# EasyEDA Pro project group_project chess_2025-11-06.epro

# Schematic Schematic1
Board Name: Board1; Create Date: 2025-10-16; Page Name: P1; Project Name: group_project chess; Schematic Name: Schematic1; Update Date: 2025-10-27; Company: EasyEDA.com; Page Size: A4; Version: V1.0
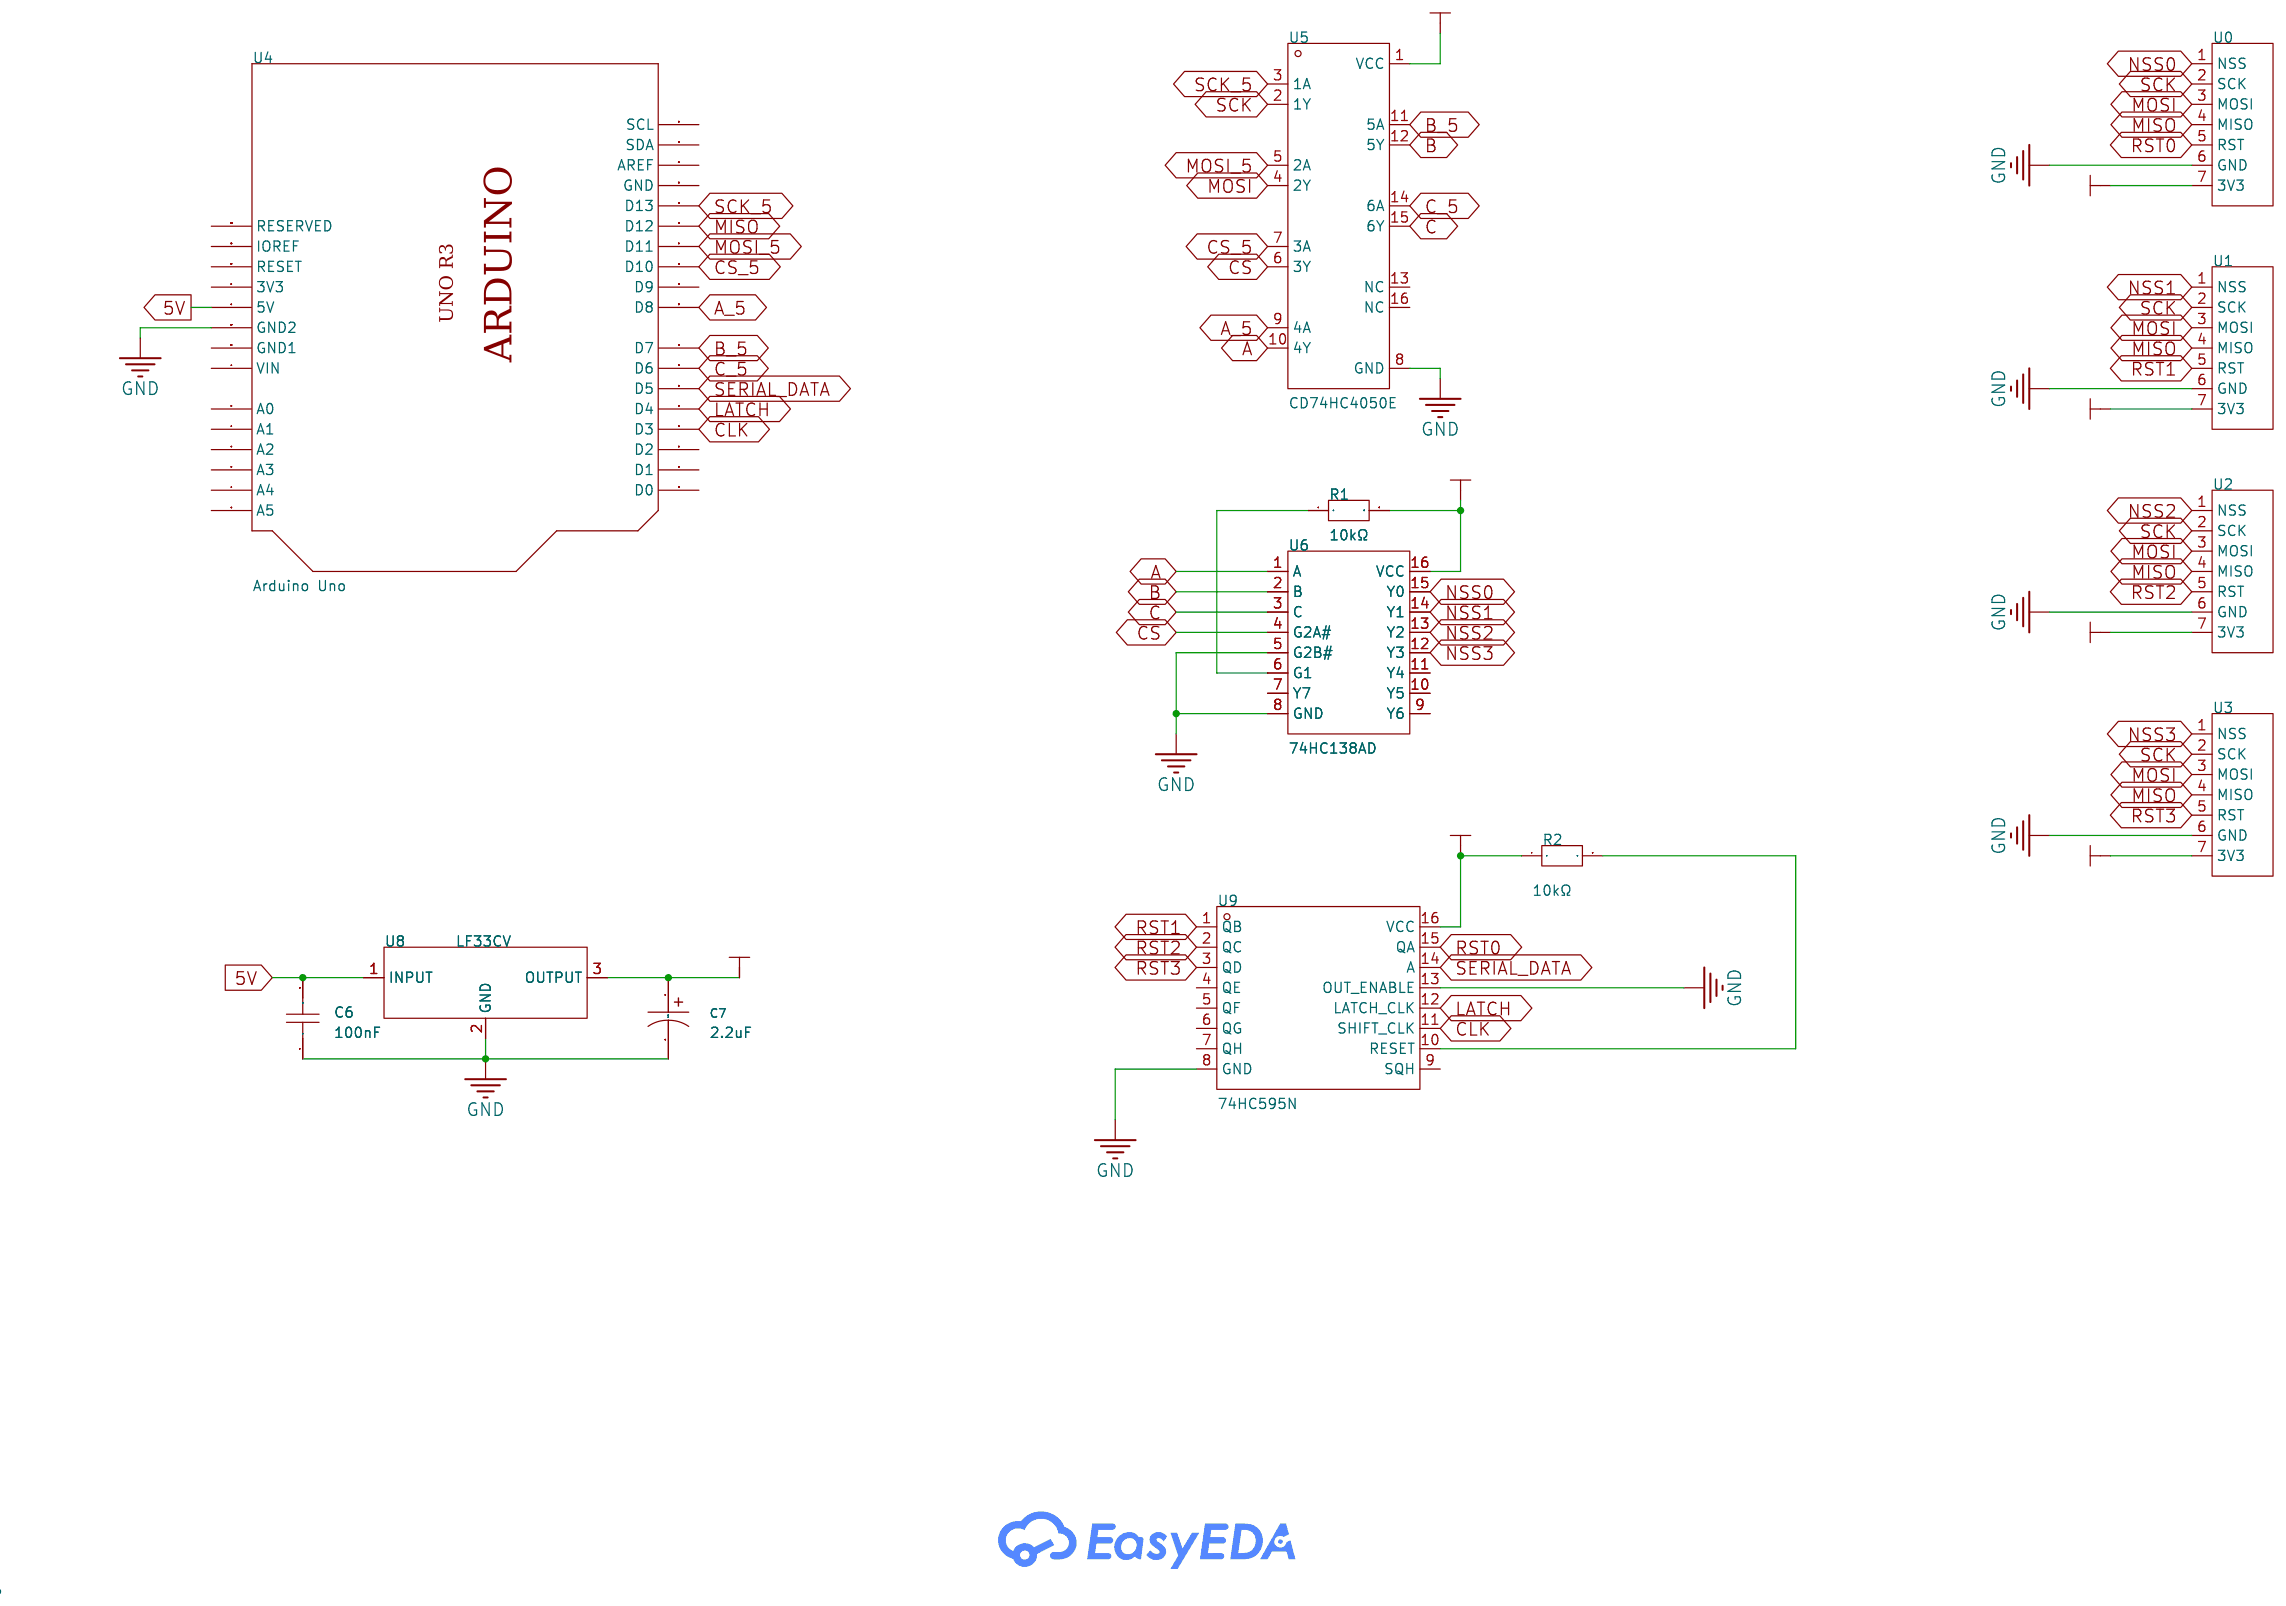
[diagram p0: schematic sheet]

## Parts
C6  100nF  [CAP-TH_L7.2-W2.5-P5.00-D0.5]
C7  2.2uF  [CAP-TH_BD6.3-P2.50-D1.0-FD]
R1  10kΩ  [RES-TH_BD2.7-L6.2-P10.20-D0.4]
R2  10kΩ  [RES-TH_BD2.7-L6.2-P10.20-D0.4]
U0  HB-PH3-25417PB2GOP  [HDR-TH_7P-P2.54-V-M]
U1  HB-PH3-25417PB2GOP  [HDR-TH_7P-P2.54-V-M]
U2  HB-PH3-25417PB2GOP  [HDR-TH_7P-P2.54-V-M]
U3  HB-PH3-25417PB2GOP  [HDR-TH_7P-P2.54-V-M]
U4  Arduino Uno  [ARDUINO-R3]
U5  CD74HC4050E  [PDIP-16_L19.3-W6.4-P2.54-LS7.94-BL]
U6  74HC138AD  [PDIP-16_L19.7-W6.6-P2.54-LS7.6-BL]
U8  LF33CV  [TO-220-3_L10.2-W4.5-P2.54-L]
U9  74HC595N  [DIP-16_L19.8-W6.5-P2.54-LS7.6-BL]

## Library data of the parts
C6 = 224CL0017: Capacitance:100nF Tolerance:±5% Tolerance:±5% Voltage Rating:63V Dielectric Material:Metallized Polyester Operating Temperature:-55℃~+105℃ Operating Temperature:-55℃~+105℃; LCSC Part Name: 100nF ±5% 63V; Supplier Part: C47917080; Manufacturer: KNSCHA(科尼盛); Supplier Footprint: 插件,P=5mm; JLCPCB Part Class: Extended Part; Datasheet: https://item.szlcsc.com/datasheet/224CL0017/50153037.html; Supplier: LCSC; Tolerance: ±5%; Voltage Rating: 63V; Dielectric Material: Metallized Polyester; Operating Temperature: -55℃~+105℃
C7 = ECG2GM2R2E09OTBO: Capacitance:2.2uF Tolerance:±20% Tolerance:±20% Voltage Rating:400V Ripple Current:70mA@100kHz Equivalent Series Resistance(ESR):- Pin Spacing:2.5mm Diameter:6.3mm Height - Seated (Max):9mm Lifetime:8000hrs@105℃; LCSC Part Name: 2.2uF ±20% 400V; Supplier Part: C525475; Manufacturer: Yunxing(云星); Supplier Footprint: 插件,D6.3xL9mm; JLCPCB Part Class: Extended Part; Datasheet: https://item.szlcsc.com/datasheet/ECG2GM2R2E09OTBO/543602.html; Supplier: LCSC; Tolerance: ±20%; Voltage Rating: 400V; Ripple Current: 70mA@100kHz; Pin Spacing: 2.5mm; Diameter: 6.3mm; Height - Seated (Max): 9mm; Lifetime: 8000hrs@105℃
R1 R2 = MF1/4W-10K±1%-ST52: Type:Metal Film Resistor Resistance:10kΩ Tolerance:±1% Tolerance:±1% Voltage-Supply(Max):250V Power(Watts):250mW Temperature Coefficient:±100ppm/℃ Temperature Coefficient:±100ppm/℃ Operating Temperature:-55℃~+155℃ Operating Temperature:-55℃~+155℃; LCSC Part Name: 金属膜电阻 10kΩ ±1% 250mW; Supplier Part: C2903232; Manufacturer: VO(翔胜); Supplier Footprint: 插件,D2.7xL6.2mm; JLCPCB Part Class: Extended Part; Datasheet: https://atta.szlcsc.com/upload/public/pdf/source/20200609/C601728_5AA4C0C8E12E11069DA2C3356F29D1F2.pdf; Supplier: LCSC; Type: Metal Film Resistor; Tolerance: ±1%; Voltage-Supply(Max): 250V; Power(Watts): 250mW; Temperature Coefficient: ±100ppm/℃; Operating Temperature: -55℃~+155℃
U0-U3 = HB-PH3-25417PB2GOP: Pin Structure:1x7P Pitch:2.54mm Row Spacing:2.54mm Circluar Pins/Square Pins:Pin Header Mounting Type:Through Hole Number of Rows:1 Number of Pins:7P Current Rating:3A Voltage Rating (Max):250V Length of Mating Pin:6mm Insulation Height:2.54mm Length of E; LCSC Part Name: 1x7P 间距:2.54mm 方针 直插; Supplier Part: C6332200; Manufacturer: HANBO(汉博); Supplier Footprint: 插件,P=2.54mm; JLCPCB Part Class: Extended Part; Datasheet: https://item.szlcsc.com/datasheet/HB-PH3-25417PB2GOP/7280440.html; Supplier: LCSC; Pin Structure: 1x7P; Pitch: 2.54mm; Row Spacing: 2.54mm; Circluar Pins/Square Pins: Pin Header; Mounting Type: Through Hole; Number of Rows: 1; Number of Pins: 7P; Current Rating: 3A; Voltage Rating (Max): 250V; Length of Mating Pin: 6mm; Insulation Height: 2.54mm; Length of End Connection Pin: 3mm; Contact Material: Brass; Contact Plating: Gold; Operating Temperature: -40℃~+105℃; Color: Black
U4 = Arduino Uno
U5 = CD74HC4050E: output type:- Voltage - Supply:2V~6V Voltage - Supply:2V~6V Number of Elements:6 Number of Bits per Element:1 Current - Output Low(IOL):5.2mA Current - Output High(IOH):5.2mA Logic Family:74HC Operating Temperature:-55℃~+125℃ Operating Temperature:-55℃~+1; LCSC Part Name: IC BUFFER NON-INVERT 6V; Supplier Part: C354050; Manufacturer: TI(德州仪器); Supplier Footprint: DIP-16; JLCPCB Part Class: Extended Part; Datasheet: https://www.ti.com/cn/lit/gpn/cd74hc4050; Supplier: LCSC; Voltage - Supply: 2V~6V; Number of Elements: 6; Number of Bits per Element: 1; Current - Output Low(IOL): 5.2mA; Current - Output High(IOH): 5.2mA; Logic Family: 74HC; Operating Temperature: -55℃~+125℃
U6 = 74HC138AD: Supplier Part: C5274768; Manufacturer: Sungine(双竞集成); Supplier Footprint: DIP-16; JLCPCB Part Class: Extended Part; Datasheet: https://item.szlcsc.com/datasheet/74HC138AD/6005906.html; Supplier: LCSC
U8 = LF33CV: Output Type:Fixed Voltage - Supply:16V Output Voltage:3.3V Output Voltage:3.3V Output Current:500mA Power Supply Rejection Ratio (PSRR):80dB@(120Hz) Voltage Dropout:700mV@(500mA) standby current:500uA Noise:50uV Features:Enable；Over Temperature Protection; LCSC Part Name: 带抑制功能的极低压降稳压器; Supplier Part: C2832779; Manufacturer: ST(意法半导体); Supplier Footprint: TO-220-3; JLCPCB Part Class: Extended Part; Datasheet: https://item.szlcsc.com/datasheet/LF33CV/2991854.html; Supplier: LCSC; Output Type: Fixed; Voltage - Supply: 16V; Output Voltage: 3.3V; Output Current: 500mA; Power Supply Rejection Ratio (PSRR): 80dB@(120Hz); Voltage Dropout: 700mV@(500mA); standby current: 500uA; Noise: 50uV; Features: Enable；Over Temperature Protection；Over Current Protection; Operating Temperature: -40℃~+125℃@(Tj); Output Configuration: Positive; Number of Outputs: 1
U9 = 74HC595N: LCSC Part Name: 74HC595N 停产; Supplier Part: C669328; Manufacturer: HTC; Supplier Footprint: DIP-16; JLCPCB Part Class: Extended Part; Datasheet: https://atta.szlcsc.com/upload/public/pdf/source/20200618/C669328_990EF01DE8E9A3CA0AEF9E0C28ED6020.pdf; Supplier: LCSC

## Nets
3V3: C7.1 R1.2 R2.1 U0.7(3V3) U1.7(3V3) U2.7(3V3) U3.7(3V3) U5.1(VCC) U6.16(VCC) U8.3(OUTPUT) U9.16(VCC)
5V: C6.2 U4.5V U8.1(INPUT)
GND: C6.1 C7.2 U0.6(GND) U1.6(GND) U2.6(GND) U3.6(GND) U4.GND2 U5.8(GND) U6.5(G2B#) U6.8(GND) U8.2(GND) U9.8(GND) U9.13(OUT_ENABLE)
A: U5.10(4Y) U6.1(A)
A_5: U4.D8 U5.9(4A)
B: U5.12(5Y) U6.2(B)
B_5: U4.D7 U5.11(5A)
C: U5.15(6Y) U6.3(C)
C_5: U4.D6 U5.14(6A)
CLK: U4.D3 U9.11(SHIFT_CLK)
CS: U5.6(3Y) U6.4(G2A#)
CS_5: U4.D10 U5.7(3A)
LATCH: U4.D4 U9.12(LATCH_CLK)
MISO: U0.4(MISO) U1.4(MISO) U2.4(MISO) U3.4(MISO) U4.D12
MOSI: U0.3(MOSI) U1.3(MOSI) U2.3(MOSI) U3.3(MOSI) U5.4(2Y)
MOSI_5: U4.D11 U5.5(2A)
NSS0: U0.1(NSS) U6.15(Y0)
NSS1: U1.1(NSS) U6.14(Y1)
NSS2: U2.1(NSS) U6.13(Y2)
NSS3: U3.1(NSS) U6.12(Y3)
RST0: U0.5(RST) U9.15(QA)
RST1: U1.5(RST) U9.1(QB)
RST2: U2.5(RST) U9.2(QC)
RST3: U3.5(RST) U9.3(QD)
SCK: U0.2(SCK) U1.2(SCK) U2.2(SCK) U3.2(SCK) U5.2(1Y)
SCK_5: U4.D13 U5.3(1A)
SERIAL_DATA: U4.D5 U9.14(A)
$1N4612: R1.1 U6.6(G1)
$1N6259: R2.2 U9.10(RESET)

Not connected (* = marked no-connect by the designer): U4 3V(3V3) A0 A1 A2 A3 A4 A5 AREF D0 D1 D2 D9 GND GND1 IOREF RESERVED RESET SCL SDA VIN; U5 13(NC) 16(NC); U6 7(Y7) 9(Y6) 10(Y5) 11(Y4); U9 4(QE) 5(QF) 6(QG) 7(QH) 9(SQH)

# Schematic Schematic2
Board Name: LCD_and_Buttons; Create Date: 2025-11-03; Page Name: P1; Project Name: group_project chess; Schematic Name: Schematic2; Update Date: 2025-11-03; Company: EasyEDA.com; Page Size: A4; Version: V1.0
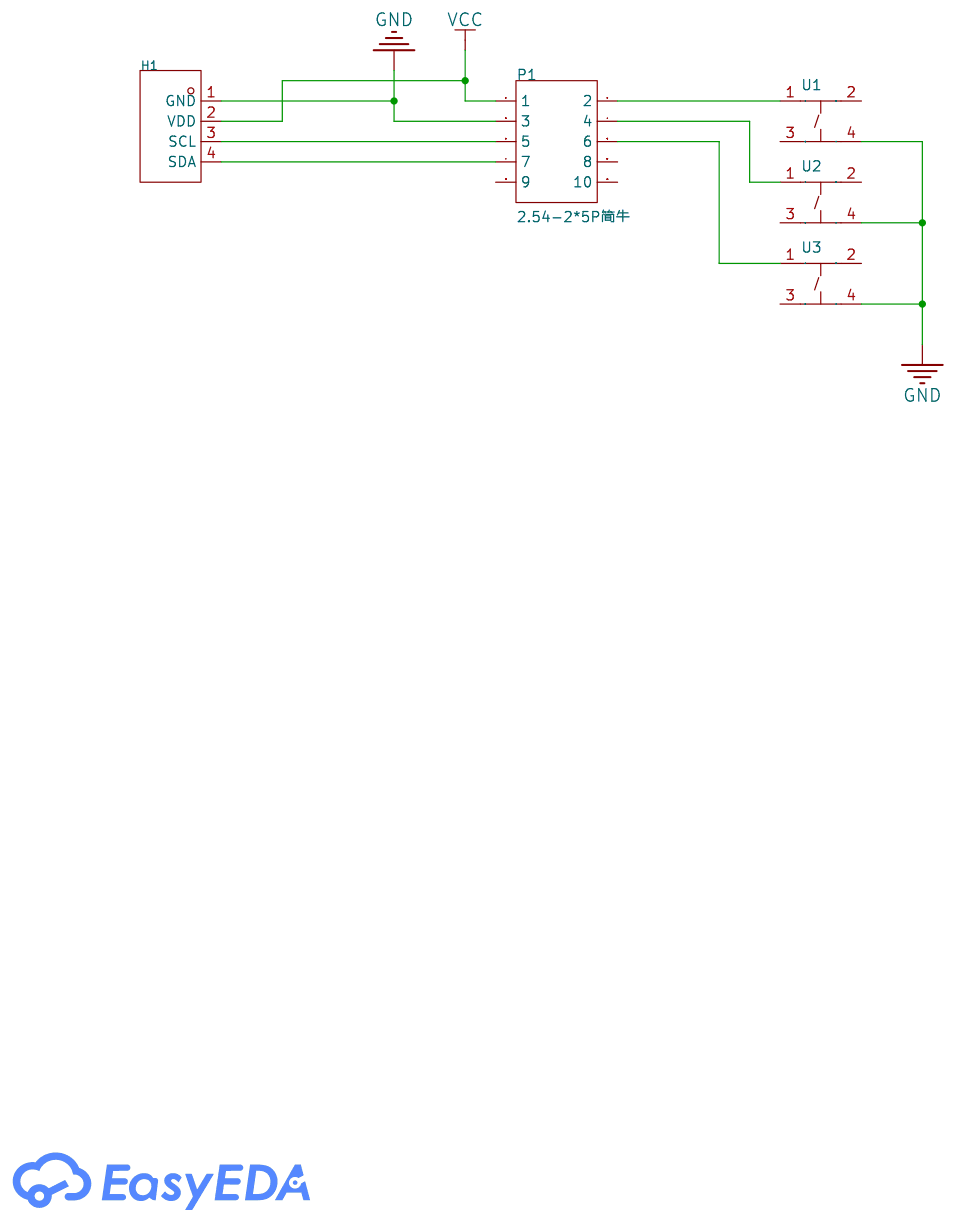
[diagram p1: schematic sheet]

## Parts
H1  PZ254V-11-04P  [HDR-TH_4P-P2.54-V-M]
P1  2.54-2*5P简牛  [IDC-TH_10P-P2.54_C5665]
U1  YZA-072-10.0  [SW-SMD_4P-L6.0-W6.0-P4.5-LS9.0-YZA-072-10.0]
U2  YZA-072-10.0  [SW-SMD_4P-L6.0-W6.0-P4.5-LS9.0-YZA-072-10.0]
U3  YZA-072-10.0  [SW-SMD_4P-L6.0-W6.0-P4.5-LS9.0-YZA-072-10.0]

## Library data of the parts
H1 = PZ254V-11-04P: Pin Structure:1x4P Pitch:2.54mm Row Spacing:- Circluar Pins/Square Pins:Pin Header Mounting Type:Through Hole Number of Rows:1 Number of Pins:4P Current Rating:3A Voltage Rating (Max):250V Length of Mating Pin:6mm Insulation Height:2.5mm Length of End Con; Supplier: LCSC; Supplier Part: C2691448; Manufacturer: XFCN(兴飞); JLCPCB Part Class: Extended Part; LCSC Part Name: 1x4P 间距:2.54mm 方针 直插; Supplier Footprint: 插件,P=2.54mm; Datasheet: https://item.szlcsc.com/datasheet/PZ254V-11-04P/2801085.html; Pin Structure: 1x4P; Pitch: 2.54mm; Circluar Pins/Square Pins: Pin Header; Mounting Type: Through Hole; Number of Rows: 1; Number of Pins: 4P; Current Rating: 3A; Voltage Rating (Max): 250V; Length of Mating Pin: 6mm; Insulation Height: 2.5mm; Length of End Connection Pin: 3mm; Operating Temperature: -40℃~+105℃; Color: Black
P1 = 2.54-2*5P简牛: Connector Type:IDC Header Pitch:2.54mm Number of Positions or Pins:2x5P Holder Type:Through Hole Row Spacing:2.54mm Number of Rows:2 Number of PINs Per Row:5 Contact Material:- Contact Plating:-; LCSC Part Name: 2.54mm 2x5P 排数:2 每排P数:5; Supplier Part: C5665; Manufacturer: BOOMELE(博穆精密); Supplier Footprint: 插件,P=2.54mm; JLCPCB Part Class: Extended Part; Datasheet: https://item.szlcsc.com/datasheet/2.54-2*5P%25E7%25AE%2580%25E7%2589%259B/6118.html; Supplier: LCSC; Connector Type: IDC Header; Pitch: 2.54mm; Number of Positions or Pins: 2x5P; Holder Type: Through Hole; Row Spacing: 2.54mm; Number of Rows: 2; Number of PINs Per Row: 5
U1-U3 = YZA-072-10.0: PressForce:260gf Switch Size:6*6*10.0MM Installation Method:正按 RatedCurrent:50mA ButtonShape:Rectangle button Circuit:SPST Lifetime:5万次 Type:轻触开关; LCSC Part Name: YIZHI(逸致) YZA-072-10.0 6*6*10.0MM贴片SMD四脚正按; Supplier Part: C49108668; Manufacturer: YIZHI(逸致); JLCPCB Part Class: Extended Part; Datasheet: https://item.szlcsc.com/datasheet/YZA-072-10.0/51487285.html; Supplier: LCSC; PressForce: 260gf; Switch Size: 6*6*10.0MM; Installation Method: 正按; RatedCurrent: 50mA; ButtonShape: Rectangle button; Circuit: SPST; Lifetime: 5万次; Type: 轻触开关

## Nets
GND: H1.1(GND) P1.3 U1.4 U2.4 U3.4
VCC: H1.2(VDD) P1.1
Net-(H1-3): H1.3(SCL) P1.5
Net-(H1-4): H1.4(SDA) P1.7
Net-(P1-2): P1.2 U1.1
Net-(P1-4): P1.4 U2.1
Net-(P1-6): P1.6 U3.1

Not connected (* = marked no-connect by the designer): P1 8 9 10; U1 2 3; U2 2 3; U3 2 3

# Schematic Schematic1_1
Board Name: Arduino_expansion; Create Date: 2025-10-29; Page Name: P1; Project Name: group_project chess; Schematic Name: Schematic1_1; Update Date: 2025-11-03; Company: EasyEDA.com; Page Size: A4; Version: V1.0
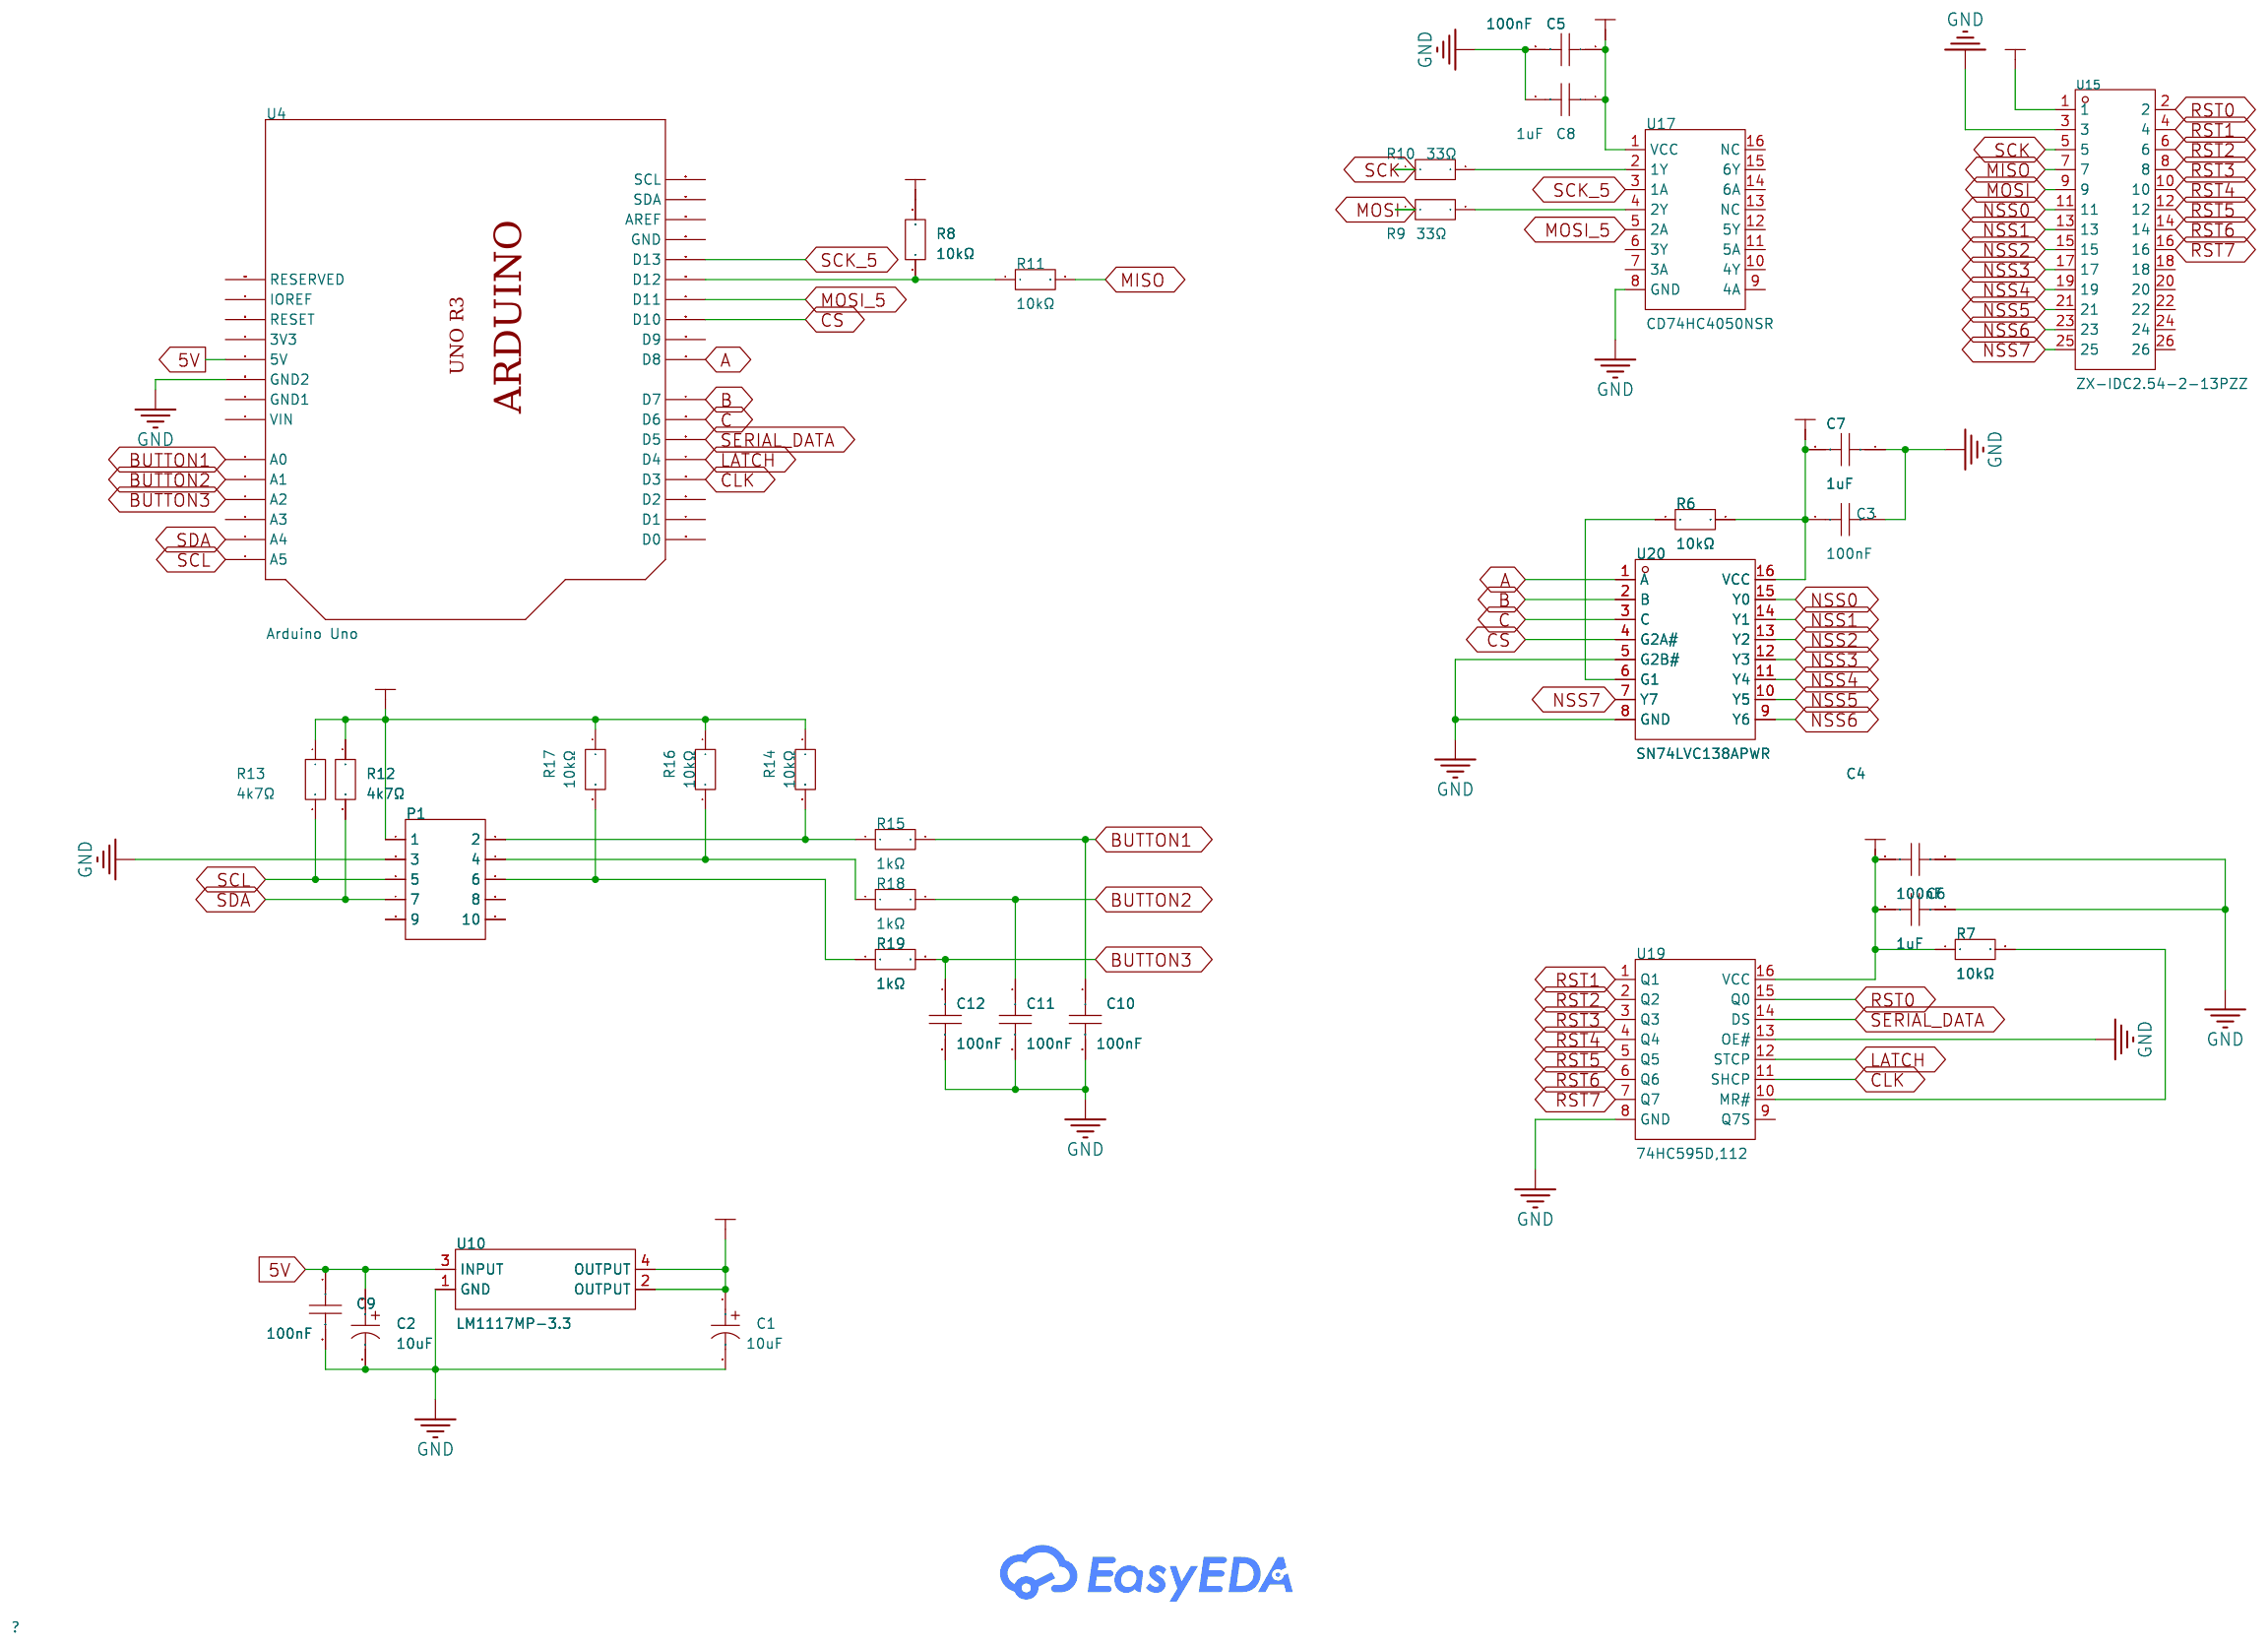
[diagram p2: schematic sheet]

## Parts
C1  10uF  [CAP-SMD_L3.5-W2.8-FD]
C2  10uF  [CAP-SMD_L3.5-W2.8-FD]
C3  100nF  [C0805]
C4  100nF  [C0805]
C5  100nF  [C0805]
C6  1uF  [C0805]
C7  1uF  [C0805]
C8  1uF  [C0805]
C9  100nF  [C0805]
C10  100nF  [C0805]
C11  100nF  [C0805]
C12  100nF  [C0805]
P1  2.54-2*5P简牛  [IDC-TH_10P-P2.54_C5665]
R6  10kΩ  [R0805]
R7  10kΩ  [R0805]
R8  10kΩ  [R0805]
R9  33Ω  [R0805]
R10  33Ω  [R0805]
R11  10kΩ  [R0805]
R12  4k7Ω  [R0805]
R13  4k7Ω  [R0805]
R14  10kΩ  [R0805]
R15  1kΩ  [R0805]
R16  10kΩ  [R0805]
R17  10kΩ  [R0805]
R18  1kΩ  [R0805]
R19  1kΩ  [R0805]
U4  Arduino Uno  [ARDUINO-R3]
U10  LM1117MP-3.3  [SOT-223-4_L6.5-W3.5-P2.30-LS7.0-BR]
U15  ZX-IDC2.54-2-13PZZ  [IDC-TH_26P-P2.54_ZX-IDC2.54-2-13PZZ]
U17  CD74HC4050NSR  [SO-16_L9.9-W3.9-P1.27-LS6.0-BL]
U19  74HC595D,112  [SO-16_L9.9-W3.9-P1.27-LS6.0-BL]
U20  SN74LVC138APWR  [TSSOP-16_L5.0-W4.4-P0.65-LS6.4-BL]

## Library data of the parts
C1 C2 = CA45-B-6.3V-220UF-M: Capacitance:220uF Tolerance:±20% Tolerance:±20% Voltage Rating:6.3V Current - Leakage:13.9uA Operating Temperature:-55℃~+125℃ Operating Temperature:-55℃~+125℃; LCSC Part Name: 220uF ±20% 6.3V; Supplier Part: C2887903; Manufacturer: CEC(振华新云); Supplier Footprint: CASE-B-3528; JLCPCB Part Class: Extended Part; Datasheet: https://item.szlcsc.com/datasheet/CA45-B-6.3V-220UF-M/3106617.html; Supplier: LCSC; Tolerance: ±20%; Voltage Rating: 6.3V; Current - Leakage: 13.9uA; Operating Temperature: -55℃~+125℃
C3-C12 = CC0805KRX7R9BB104: Capacitance:100nF Tolerance:±10% Tolerance:±10% Voltage Rating:50V Temperature Coefficient:X7R; LCSC Part Name: 100nF ±10% 50V; Supplier Part: C49678; Manufacturer: YAGEO(国巨); Supplier Footprint: 0805; JLCPCB Part Class: Basic Part; Datasheet: https://item.szlcsc.com/datasheet/CC0805KRX7R9BB104/50686.html; Supplier: LCSC; Tolerance: ±10%; Voltage Rating: 50V; Temperature Coefficient: X7R
P1 = 2.54-2*5P简牛: Connector Type:IDC Header Pitch:2.54mm Number of Positions or Pins:2x5P Holder Type:Through Hole Row Spacing:2.54mm Number of Rows:2 Number of PINs Per Row:5 Contact Material:- Contact Plating:-; LCSC Part Name: 2.54mm 2x5P 排数:2 每排P数:5; Supplier Part: C5665; Manufacturer: BOOMELE(博穆精密); Supplier Footprint: 插件,P=2.54mm; JLCPCB Part Class: Extended Part; Datasheet: https://item.szlcsc.com/datasheet/2.54-2*5P%25E7%25AE%2580%25E7%2589%259B/6118.html; Supplier: LCSC; Connector Type: IDC Header; Pitch: 2.54mm; Number of Positions or Pins: 2x5P; Holder Type: Through Hole; Row Spacing: 2.54mm; Number of Rows: 2; Number of PINs Per Row: 5
R6-R19 = FRC0805J103TS: Type:Thick Film Resistor Resistance:10kΩ Tolerance:±5% Tolerance:±5% Power(Watts):125mW Voltage-Supply(Max):150V Temperature Coefficient:±100ppm/℃ Temperature Coefficient:±100ppm/℃ Operating Temperature:-55℃~+155℃ Operating Temperature:-55℃~+155℃; LCSC Part Name: 10kΩ ±5% 125mW 厚膜电阻; Supplier Part: C2930231; Manufacturer: FOJAN(富捷); Supplier Footprint: 0805; JLCPCB Part Class: Extended Part; Supplier: LCSC; Type: Thick Film Resistor; Tolerance: ±5%; Power(Watts): 125mW; Voltage-Supply(Max): 150V; Temperature Coefficient: ±100ppm/℃; Operating Temperature: -55℃~+155℃
U4 = Arduino Uno
U10 = LM1117MP-3.3: Output Type:Fixed Voltage - Supply:15V Output Voltage:3.3V Output Voltage:3.3V Output Current:800mA Power Supply Rejection Ratio (PSRR):75dB@(120Hz) Voltage Dropout:1.2V@(800mA) standby current:5mA Noise:99uVrms Features:Over Temperature Protection；Over C; Supplier Part: C3750685; Manufacturer: TI(德州仪器); Supplier Footprint: SOT-223; JLCPCB Part Class: Extended Part; Supplier: LCSC; Output Type: Fixed; Voltage - Supply: 15V; Output Voltage: 3.3V; Output Current: 800mA; Power Supply Rejection Ratio (PSRR): 75dB@(120Hz); Voltage Dropout: 1.2V@(800mA); standby current: 5mA; Noise: 99uVrms; Features: Over Temperature Protection；Over Current Protection; Operating Temperature: 0℃~+125℃@(Ta); Output Configuration: Positive; Number of Outputs: 1
U15 = ZX-IDC2.54-2-13PZZ: Connector Type:IDC Header Pitch:2.54mm Number of Positions or Pins:2x13P Current Rating:3A Voltage Rating (Max):1kV Holder Type:Through Hole Row Spacing:2.54mm Number of Rows:2 Number of PINs Per Row:13 Contact Material:Brass Contact Plating:Gold Operatin; LCSC Part Name: 2.54mm 2x13P 排数:2 每排P数:13; Supplier Part: C7501247; Manufacturer: Megastar(兆星); Supplier Footprint: 插件,P=2.54mm; JLCPCB Part Class: Extended Part; Datasheet: https://item.szlcsc.com/datasheet/ZX-IDC2.54-2-13PZZ/8582460.html; Supplier: LCSC; Connector Type: IDC Header; Pitch: 2.54mm; Number of Positions or Pins: 2x13P; Current Rating: 3A; Voltage Rating (Max): 1kV; Holder Type: Through Hole; Row Spacing: 2.54mm; Number of Rows: 2; Number of PINs Per Row: 13; Contact Material: Brass; Contact Plating: Gold; Operating Temperature: -40℃~+105℃
U17 = CD74HC4050NSR: Input type:- output type:- Voltage - Supply:2V~6V Voltage - Supply:2V~6V Number of Elements:6 Number of Bits per Element:1 Current - Output Low(IOL):5.2mA Current - Output High(IOH):5.2mA Logic Family:74HC Operating Temperature:-55℃~+125℃ Operating Temper; Supplier Part: C1849443; Manufacturer: TI(德州仪器); Supplier Footprint: SO-16; JLCPCB Part Class: Extended Part; Datasheet: https://www.ti.com/cn/lit/gpn/cd74hc4050; Supplier: LCSC; Voltage - Supply: 2V~6V; Number of Elements: 6; Number of Bits per Element: 1; Current - Output Low(IOL): 5.2mA; Current - Output High(IOH): 5.2mA; Logic Family: 74HC; Operating Temperature: -55℃~+125℃
U19 = 74HC595D,112: Function:- Output Type:- Series:-; Supplier Part: C547124; Manufacturer: Nexperia(安世); Supplier Footprint: SO-16; JLCPCB Part Class: Extended Part; Datasheet: https://item.szlcsc.com/datasheet/74HC595D%252C112/568254.html; Supplier: LCSC
U20 = SN74LVC138APWR: Type:Decoder/Demultiplexers Voltage Supply Source:Single supply Voltage - Supply:1.65V~3.6V Voltage - Supply:1.65V~3.6V Current - Output Low(IOL):24mA Current - Output High(IOH):- Operating temperature:-40℃~+85℃ Operating temperature:-40℃~+85℃; Supplier Part: C485077; Manufacturer: TI(德州仪器); Supplier Footprint: TSSOP-16; JLCPCB Part Class: Extended Part; Datasheet: https://www.ti.com/cn/lit/gpn/sn74lvc138a; Supplier: LCSC; Type: Decoder/Demultiplexers; Voltage Supply Source: Single supply; Voltage - Supply: 1.65V~3.6V; Current - Output Low(IOL): 24mA; Operating temperature: -40℃~+85℃

## Nets
3V3: C1.1 C3.2 C4.2 C5.1 C6.2 C7.2 C8.1 P1.1 R6.2 R7.1 R8.2 R12.1 R13.1 R14.1 R16.1 R17.1 U10.2(OUTPUT) U10.4(OUTPUT) U15.1 U17.1(VCC) U19.16(VCC) U20.16(VCC)
5V: C2.1 C9.1 U4.5V U10.3(INPUT)
GND: C1.2 C2.2 C3.1 C4.1 C5.2 C6.1 C7.1 C8.2 C9.2 C10.2 C11.2 C12.2 P1.3 U4.GND2 U10.1(GND) U15.3 U17.8(GND) U19.8(GND) U19.13(OE#) U20.5(G2B#) U20.8(GND)
A: U4.D8 U20.1(A)
B: U4.D7 U20.2(B)
BUTTON1: C10.1 R15.2 U4.A0
BUTTON2: C11.1 R18.2 U4.A1
BUTTON3: C12.1 R19.2 U4.A2
C: U4.D6 U20.3(C)
CLK: U4.D3 U19.11(SHCP)
CS: U4.D10 U20.4(G2A#)
LATCH: U4.D4 U19.12(STCP)
MISO: R11.2 U15.7
MOSI: R9.1 U15.9
MOSI_5: U4.D11 U17.5(2A)
NSS0: U15.11 U20.15(Y0)
NSS1: U15.13 U20.14(Y1)
NSS2: U15.15 U20.13(Y2)
NSS3: U15.17 U20.12(Y3)
NSS4: U15.19 U20.11(Y4)
NSS5: U15.21 U20.10(Y5)
NSS6: U15.23 U20.9(Y6)
NSS7: U15.25 U20.7(Y7)
RST0: U15.2 U19.15(Q0)
RST1: U15.4 U19.1(Q1)
RST2: U15.6 U19.2(Q2)
RST3: U15.8 U19.3(Q3)
RST4: U15.10 U19.4(Q4)
RST5: U15.12 U19.5(Q5)
RST6: U15.14 U19.6(Q6)
RST7: U15.16 U19.7(Q7)
SCK: R10.1 U15.5
SCK_5: U4.D13 U17.3(1A)
SCL: P1.5 R13.2 U4.A5
SDA: P1.7 R12.2 U4.A4
SERIAL_DATA: U4.D5 U19.14(DS)
$1N4612: R6.1 U20.6(G1)
$1N11217: R9.2 U17.4(2Y)
$1N11260: R10.2 U17.2(1Y)
$1N11303: R8.1 R11.1 U4.D12
$1N11361: R7.2 U19.10(MR#)
$1N13694: P1.2 R14.2 R15.1
$1N13954: P1.4 R16.2 R18.1
$1N14026: P1.6 R17.2 R19.1

Not connected (* = marked no-connect by the designer): P1 8 9 10; U4 3V(3V3) A3 AREF D0 D1 D2 D9 GND GND1 IOREF RESERVED RESET SCL SDA VIN; U15 18 20 22 24 26; U17 6(3Y) 7(3A) 9(4A) 10(4Y) 11(5A) 12(5Y) 13(NC) 14(6A) 15(6Y) 16(NC); U19 9(Q7S)

# Schematic Schematic3
Board Name: Big_board; Create Date: 2025-11-05; Page Name: P1; Project Name: group_project chess; Schematic Name: Schematic3; Update Date: 2025-11-05; Company: EasyEDA.com; Page Size: A4; Version: V1.0
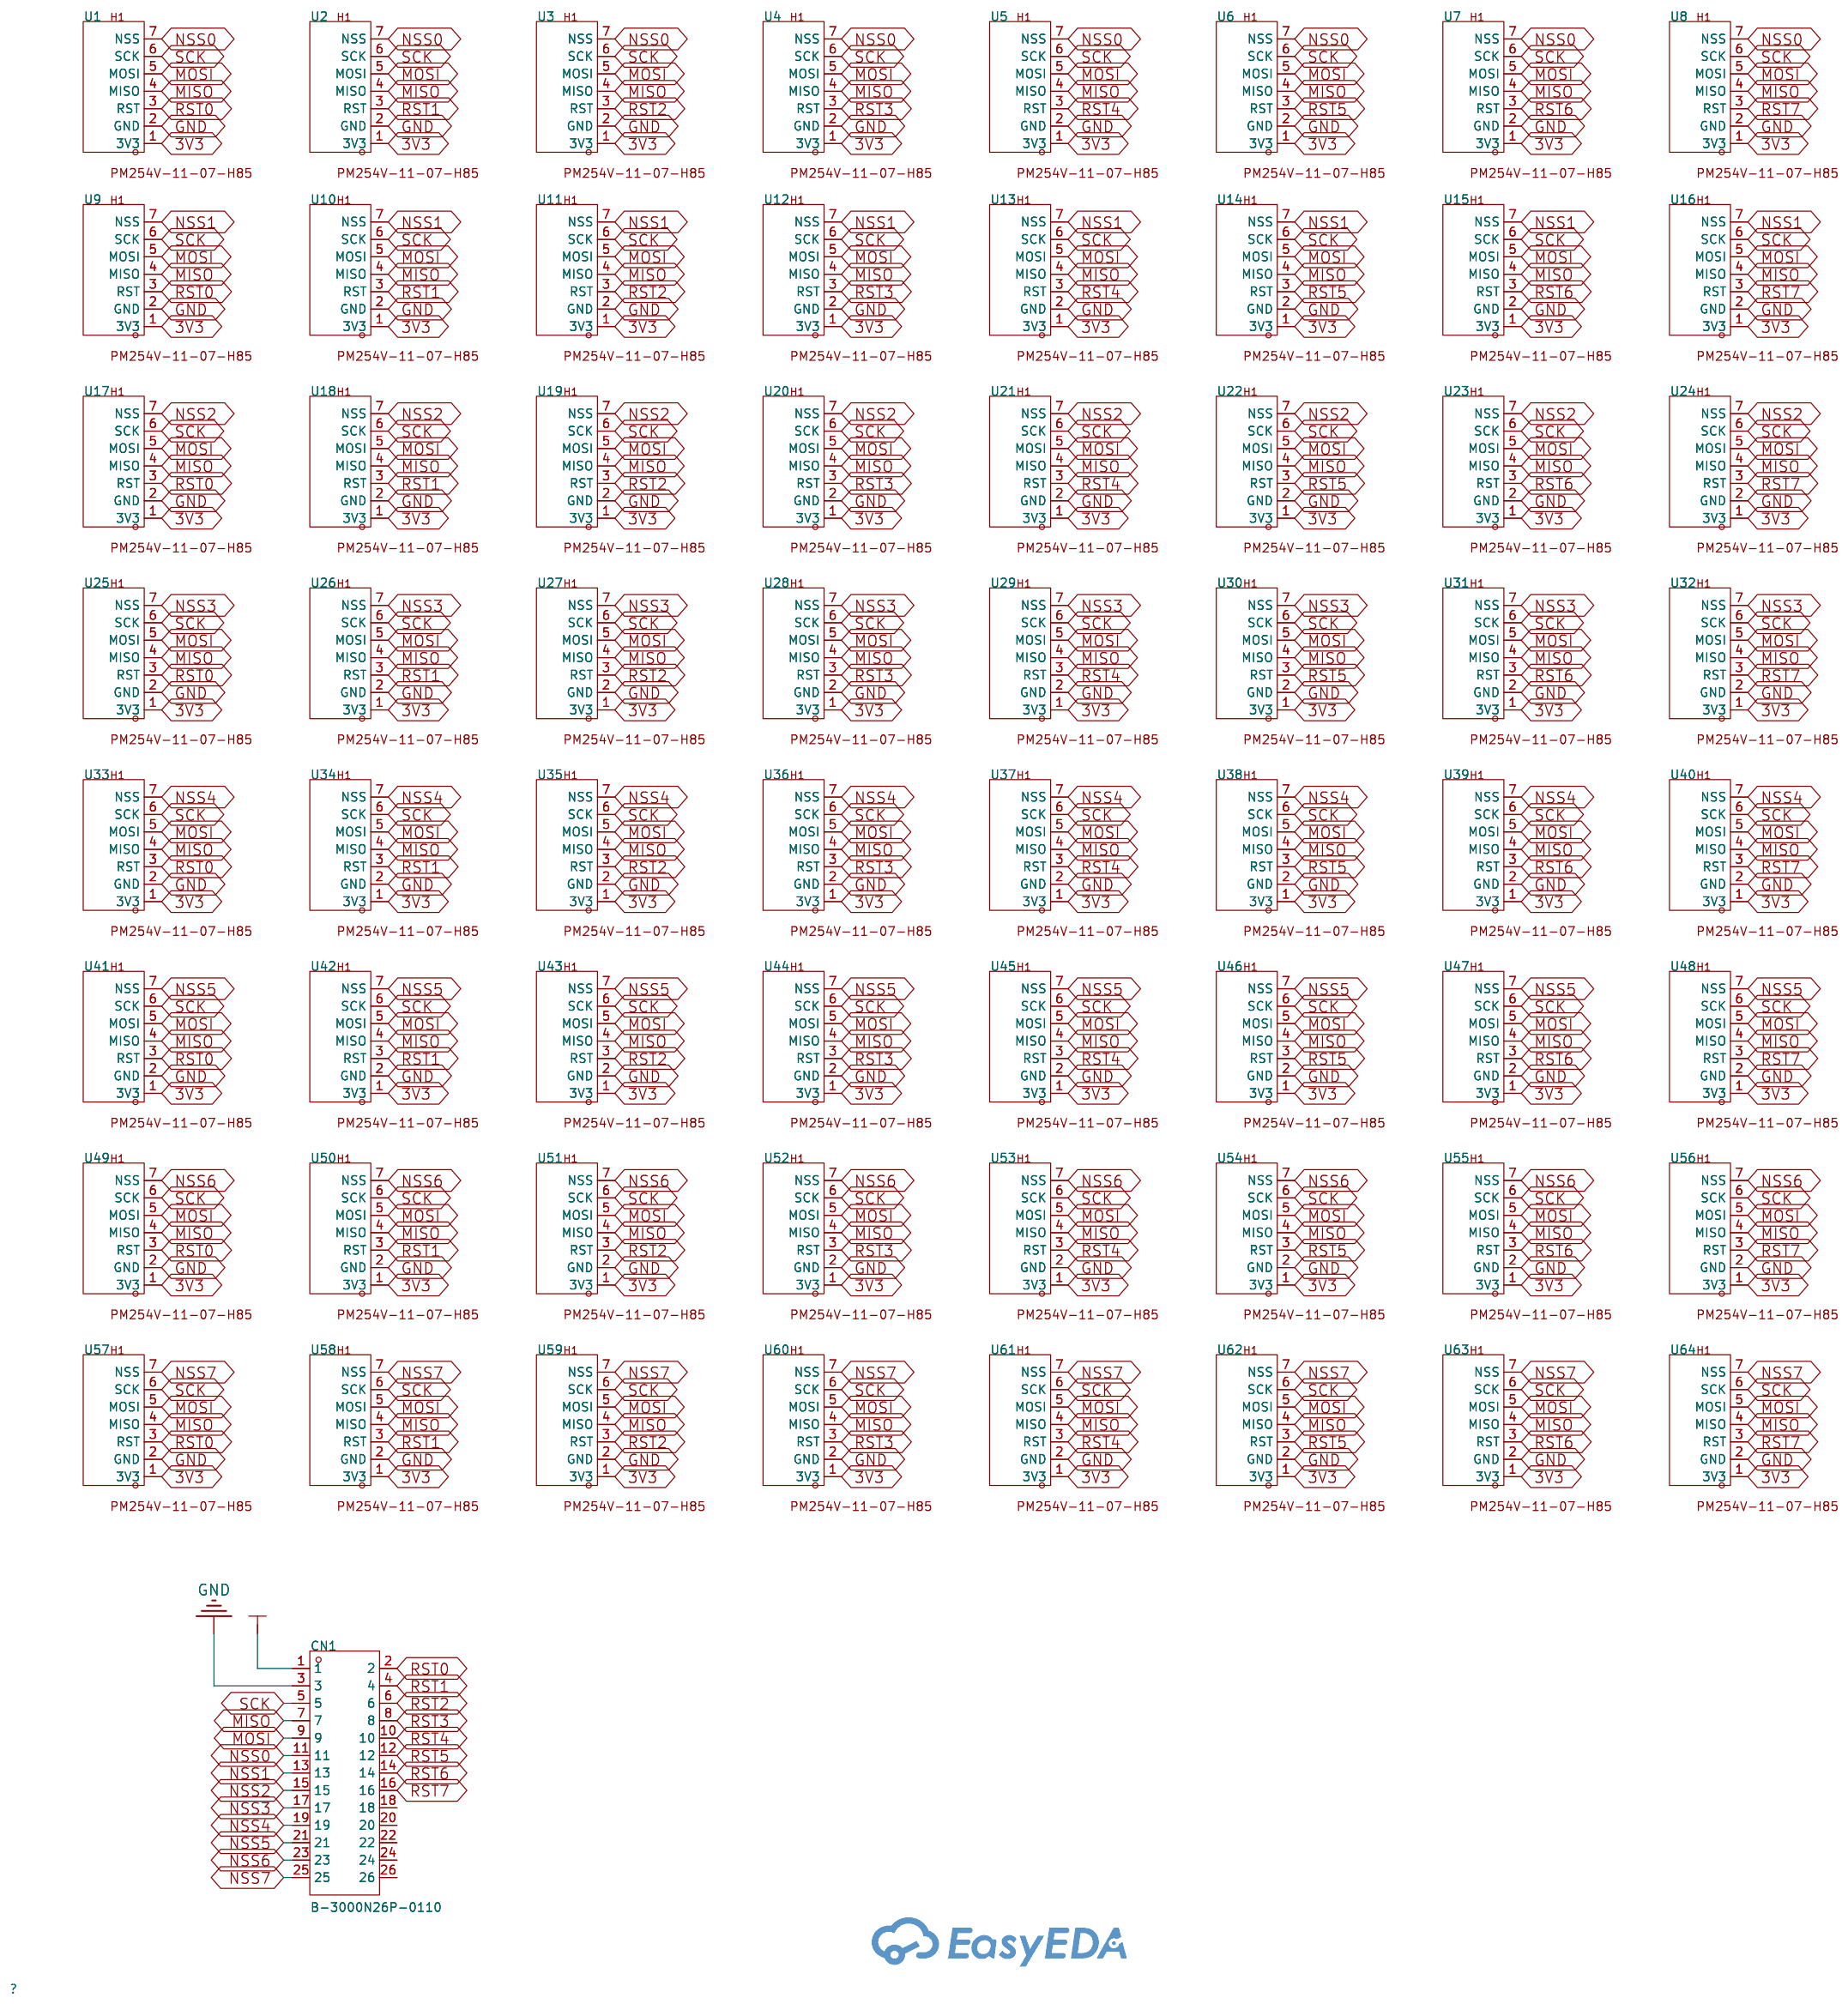
[diagram p3: schematic sheet]

## Parts
CN1  B-3000N26P-0110  [IDC-SMD_26P-P2.54_B-3000N26P-0110]
U1  -  [pin_header]
U2  -  [pin_header]
U3  -  [pin_header]
U4  -  [pin_header]
U5  -  [pin_header]
U6  -  [pin_header]
U7  -  [pin_header]
U8  -  [pin_header]
U9  -  [pin_header]
U10  -  [pin_header]
U11  -  [pin_header]
U12  -  [pin_header]
U13  -  [pin_header]
U14  -  [pin_header]
U15  -  [pin_header]
U16  -  [pin_header]
U17  -  [pin_header]
U18  -  [pin_header]
U19  -  [pin_header]
U20  -  [pin_header]
U21  -  [pin_header]
U22  -  [pin_header]
U23  -  [pin_header]
U24  -  [pin_header]
U25  -  [pin_header]
U26  -  [pin_header]
U27  -  [pin_header]
U28  -  [pin_header]
U29  -  [pin_header]
U30  -  [pin_header]
U31  -  [pin_header]
U32  -  [pin_header]
U33  -  [pin_header]
U34  -  [pin_header]
U35  -  [pin_header]
U36  -  [pin_header]
U37  -  [pin_header]
U38  -  [pin_header]
U39  -  [pin_header]
U40  -  [pin_header]
U41  -  [pin_header]
U42  -  [pin_header]
U43  -  [pin_header]
U44  -  [pin_header]
U45  -  [pin_header]
U46  -  [pin_header]
U47  -  [pin_header]
U48  -  [pin_header]
U49  -  [pin_header]
U50  -  [pin_header]
U51  -  [pin_header]
U52  -  [pin_header]
U53  -  [pin_header]
U54  -  [pin_header]
U55  -  [pin_header]
U56  -  [pin_header]
U57  -  [pin_header]
U58  -  [pin_header]
U59  -  [pin_header]
U60  -  [pin_header]
U61  -  [pin_header]
U62  -  [pin_header]
U63  -  [pin_header]
U64  -  [pin_header]

## Library data of the parts
CN1 = B-3000N26P-0110: Connector Type:简牛座 Pitch:2.54mm Structure:2x13P Holder Type:Brick nogging Row Spacing:2.54mm Number of Rows:2 Pin Number in each Row:13 Contact Material:Brass Contact Plating:-; LCSC Part Name: 2.54mm 2x13P 排数:2 每排P数:13; Supplier Part: C383612; Manufacturer: Ckmtw(灿科盟); Supplier Footprint: SMD,P=2.54mm; JLCPCB Part Class: Extended Part; Datasheet: https://atta.szlcsc.com/upload/public/pdf/source/20210819/EF893D1E70FA66E68F7407481BD50F8A.pdf; Supplier: LCSC; Connector Type: 简牛座; Pitch: 2.54mm; Structure: 2x13P; Holder Type: Brick nogging; Row Spacing: 2.54mm; Number of Rows: 2; Pin Number in each Row: 13; Contact Material: Brass
U1-U64 = RC522_module: rc522 module 13MHz 25x35mm

## Nets
3V3: CN1.1 U1.1(3V3) U2.1(3V3) U3.1(3V3) U4.1(3V3) U5.1(3V3) U6.1(3V3) U7.1(3V3) U8.1(3V3) U9.1(3V3) U10.1(3V3) U11.1(3V3) U12.1(3V3) U13.1(3V3) U14.1(3V3) U15.1(3V3) U16.1(3V3) U17.1(3V3) U18.1(3V3) U19.1(3V3) U20.1(3V3) U21.1(3V3) U22.1(3V3) U23.1(3V3) U24.1(3V3) U25.1(3V3) U26.1(3V3) U27.1(3V3) U28.1(3V3) U29.1(3V3) U30.1(3V3) U31.1(3V3) U32.1(3V3) U33.1(3V3) U34.1(3V3) U35.1(3V3) U36.1(3V3) U37.1(3V3) U38.1(3V3) U39.1(3V3) U40.1(3V3) U41.1(3V3) U42.1(3V3) U43.1(3V3) U44.1(3V3) U45.1(3V3) U46.1(3V3) U47.1(3V3) U48.1(3V3) U49.1(3V3) U50.1(3V3) U51.1(3V3) U52.1(3V3) U53.1(3V3) U54.1(3V3) U55.1(3V3) U56.1(3V3) U57.1(3V3) U58.1(3V3) U59.1(3V3) U60.1(3V3) U61.1(3V3) U62.1(3V3) U63.1(3V3) U64.1(3V3)
GND: CN1.3 U1.2(GND) U2.2(GND) U3.2(GND) U4.2(GND) U5.2(GND) U6.2(GND) U7.2(GND) U8.2(GND) U9.2(GND) U10.2(GND) U11.2(GND) U12.2(GND) U13.2(GND) U14.2(GND) U15.2(GND) U16.2(GND) U17.2(GND) U18.2(GND) U19.2(GND) U20.2(GND) U21.2(GND) U22.2(GND) U23.2(GND) U24.2(GND) U25.2(GND) U26.2(GND) U27.2(GND) U28.2(GND) U29.2(GND) U30.2(GND) U31.2(GND) U32.2(GND) U33.2(GND) U34.2(GND) U35.2(GND) U36.2(GND) U37.2(GND) U38.2(GND) U39.2(GND) U40.2(GND) U41.2(GND) U42.2(GND) U43.2(GND) U44.2(GND) U45.2(GND) U46.2(GND) U47.2(GND) U48.2(GND) U49.2(GND) U50.2(GND) U51.2(GND) U52.2(GND) U53.2(GND) U54.2(GND) U55.2(GND) U56.2(GND) U57.2(GND) U58.2(GND) U59.2(GND) U60.2(GND) U61.2(GND) U62.2(GND) U63.2(GND) U64.2(GND)
MISO: CN1.7 U1.4(MISO) U2.4(MISO) U3.4(MISO) U4.4(MISO) U5.4(MISO) U6.4(MISO) U7.4(MISO) U8.4(MISO) U9.4(MISO) U10.4(MISO) U11.4(MISO) U12.4(MISO) U13.4(MISO) U14.4(MISO) U15.4(MISO) U16.4(MISO) U17.4(MISO) U18.4(MISO) U19.4(MISO) U20.4(MISO) U21.4(MISO) U22.4(MISO) U23.4(MISO) U24.4(MISO) U25.4(MISO) U26.4(MISO) U27.4(MISO) U28.4(MISO) U29.4(MISO) U30.4(MISO) U31.4(MISO) U32.4(MISO) U33.4(MISO) U34.4(MISO) U35.4(MISO) U36.4(MISO) U37.4(MISO) U38.4(MISO) U39.4(MISO) U40.4(MISO) U41.4(MISO) U42.4(MISO) U43.4(MISO) U44.4(MISO) U45.4(MISO) U46.4(MISO) U47.4(MISO) U48.4(MISO) U49.4(MISO) U50.4(MISO) U51.4(MISO) U52.4(MISO) U53.4(MISO) U54.4(MISO) U55.4(MISO) U56.4(MISO) U57.4(MISO) U58.4(MISO) U59.4(MISO) U60.4(MISO) U61.4(MISO) U62.4(MISO) U63.4(MISO) U64.4(MISO)
MOSI: CN1.9 U1.5(MOSI) U2.5(MOSI) U3.5(MOSI) U4.5(MOSI) U5.5(MOSI) U6.5(MOSI) U7.5(MOSI) U8.5(MOSI) U9.5(MOSI) U10.5(MOSI) U11.5(MOSI) U12.5(MOSI) U13.5(MOSI) U14.5(MOSI) U15.5(MOSI) U16.5(MOSI) U17.5(MOSI) U18.5(MOSI) U19.5(MOSI) U20.5(MOSI) U21.5(MOSI) U22.5(MOSI) U23.5(MOSI) U24.5(MOSI) U25.5(MOSI) U26.5(MOSI) U27.5(MOSI) U28.5(MOSI) U29.5(MOSI) U30.5(MOSI) U31.5(MOSI) U32.5(MOSI) U33.5(MOSI) U34.5(MOSI) U35.5(MOSI) U36.5(MOSI) U37.5(MOSI) U38.5(MOSI) U39.5(MOSI) U40.5(MOSI) U41.5(MOSI) U42.5(MOSI) U43.5(MOSI) U44.5(MOSI) U45.5(MOSI) U46.5(MOSI) U47.5(MOSI) U48.5(MOSI) U49.5(MOSI) U50.5(MOSI) U51.5(MOSI) U52.5(MOSI) U53.5(MOSI) U54.5(MOSI) U55.5(MOSI) U56.5(MOSI) U57.5(MOSI) U58.5(MOSI) U59.5(MOSI) U60.5(MOSI) U61.5(MOSI) U62.5(MOSI) U63.5(MOSI) U64.5(MOSI)
NSS0: CN1.11 U1.7(NSS) U2.7(NSS) U3.7(NSS) U4.7(NSS) U5.7(NSS) U6.7(NSS) U7.7(NSS) U8.7(NSS)
NSS1: CN1.13 U9.7(NSS) U10.7(NSS) U11.7(NSS) U12.7(NSS) U13.7(NSS) U14.7(NSS) U15.7(NSS) U16.7(NSS)
NSS2: CN1.15 U17.7(NSS) U18.7(NSS) U19.7(NSS) U20.7(NSS) U21.7(NSS) U22.7(NSS) U23.7(NSS) U24.7(NSS)
NSS3: CN1.17 U25.7(NSS) U26.7(NSS) U27.7(NSS) U28.7(NSS) U29.7(NSS) U30.7(NSS) U31.7(NSS) U32.7(NSS)
NSS4: CN1.19 U33.7(NSS) U34.7(NSS) U35.7(NSS) U36.7(NSS) U37.7(NSS) U38.7(NSS) U39.7(NSS) U40.7(NSS)
NSS5: CN1.21 U41.7(NSS) U42.7(NSS) U43.7(NSS) U44.7(NSS) U45.7(NSS) U46.7(NSS) U47.7(NSS) U48.7(NSS)
NSS6: CN1.23 U49.7(NSS) U50.7(NSS) U51.7(NSS) U52.7(NSS) U53.7(NSS) U54.7(NSS) U55.7(NSS) U56.7(NSS)
NSS7: CN1.25 U57.7(NSS) U58.7(NSS) U59.7(NSS) U60.7(NSS) U61.7(NSS) U62.7(NSS) U63.7(NSS) U64.7(NSS)
RST0: CN1.2 U1.3(RST) U9.3(RST) U17.3(RST) U25.3(RST) U33.3(RST) U41.3(RST) U49.3(RST) U57.3(RST)
RST1: CN1.4 U2.3(RST) U10.3(RST) U18.3(RST) U26.3(RST) U34.3(RST) U42.3(RST) U50.3(RST) U58.3(RST)
RST2: CN1.6 U3.3(RST) U11.3(RST) U19.3(RST) U27.3(RST) U35.3(RST) U43.3(RST) U51.3(RST) U59.3(RST)
RST3: CN1.8 U4.3(RST) U12.3(RST) U20.3(RST) U28.3(RST) U36.3(RST) U44.3(RST) U52.3(RST) U60.3(RST)
RST4: CN1.10 U5.3(RST) U13.3(RST) U21.3(RST) U29.3(RST) U37.3(RST) U45.3(RST) U53.3(RST) U61.3(RST)
RST5: CN1.12 U6.3(RST) U14.3(RST) U22.3(RST) U30.3(RST) U38.3(RST) U46.3(RST) U54.3(RST) U62.3(RST)
RST6: CN1.14 U7.3(RST) U15.3(RST) U23.3(RST) U31.3(RST) U39.3(RST) U47.3(RST) U55.3(RST) U63.3(RST)
RST7: CN1.16 U8.3(RST) U16.3(RST) U24.3(RST) U32.3(RST) U40.3(RST) U48.3(RST) U56.3(RST) U64.3(RST)
SCK: CN1.5 U1.6(SCK) U2.6(SCK) U3.6(SCK) U4.6(SCK) U5.6(SCK) U6.6(SCK) U7.6(SCK) U8.6(SCK) U9.6(SCK) U10.6(SCK) U11.6(SCK) U12.6(SCK) U13.6(SCK) U14.6(SCK) U15.6(SCK) U16.6(SCK) U17.6(SCK) U18.6(SCK) U19.6(SCK) U20.6(SCK) U21.6(SCK) U22.6(SCK) U23.6(SCK) U24.6(SCK) U25.6(SCK) U26.6(SCK) U27.6(SCK) U28.6(SCK) U29.6(SCK) U30.6(SCK) U31.6(SCK) U32.6(SCK) U33.6(SCK) U34.6(SCK) U35.6(SCK) U36.6(SCK) U37.6(SCK) U38.6(SCK) U39.6(SCK) U40.6(SCK) U41.6(SCK) U42.6(SCK) U43.6(SCK) U44.6(SCK) U45.6(SCK) U46.6(SCK) U47.6(SCK) U48.6(SCK) U49.6(SCK) U50.6(SCK) U51.6(SCK) U52.6(SCK) U53.6(SCK) U54.6(SCK) U55.6(SCK) U56.6(SCK) U57.6(SCK) U58.6(SCK) U59.6(SCK) U60.6(SCK) U61.6(SCK) U62.6(SCK) U63.6(SCK) U64.6(SCK)

Not connected (* = marked no-connect by the designer): CN1 18 20 22 24 26

# Board PCB1
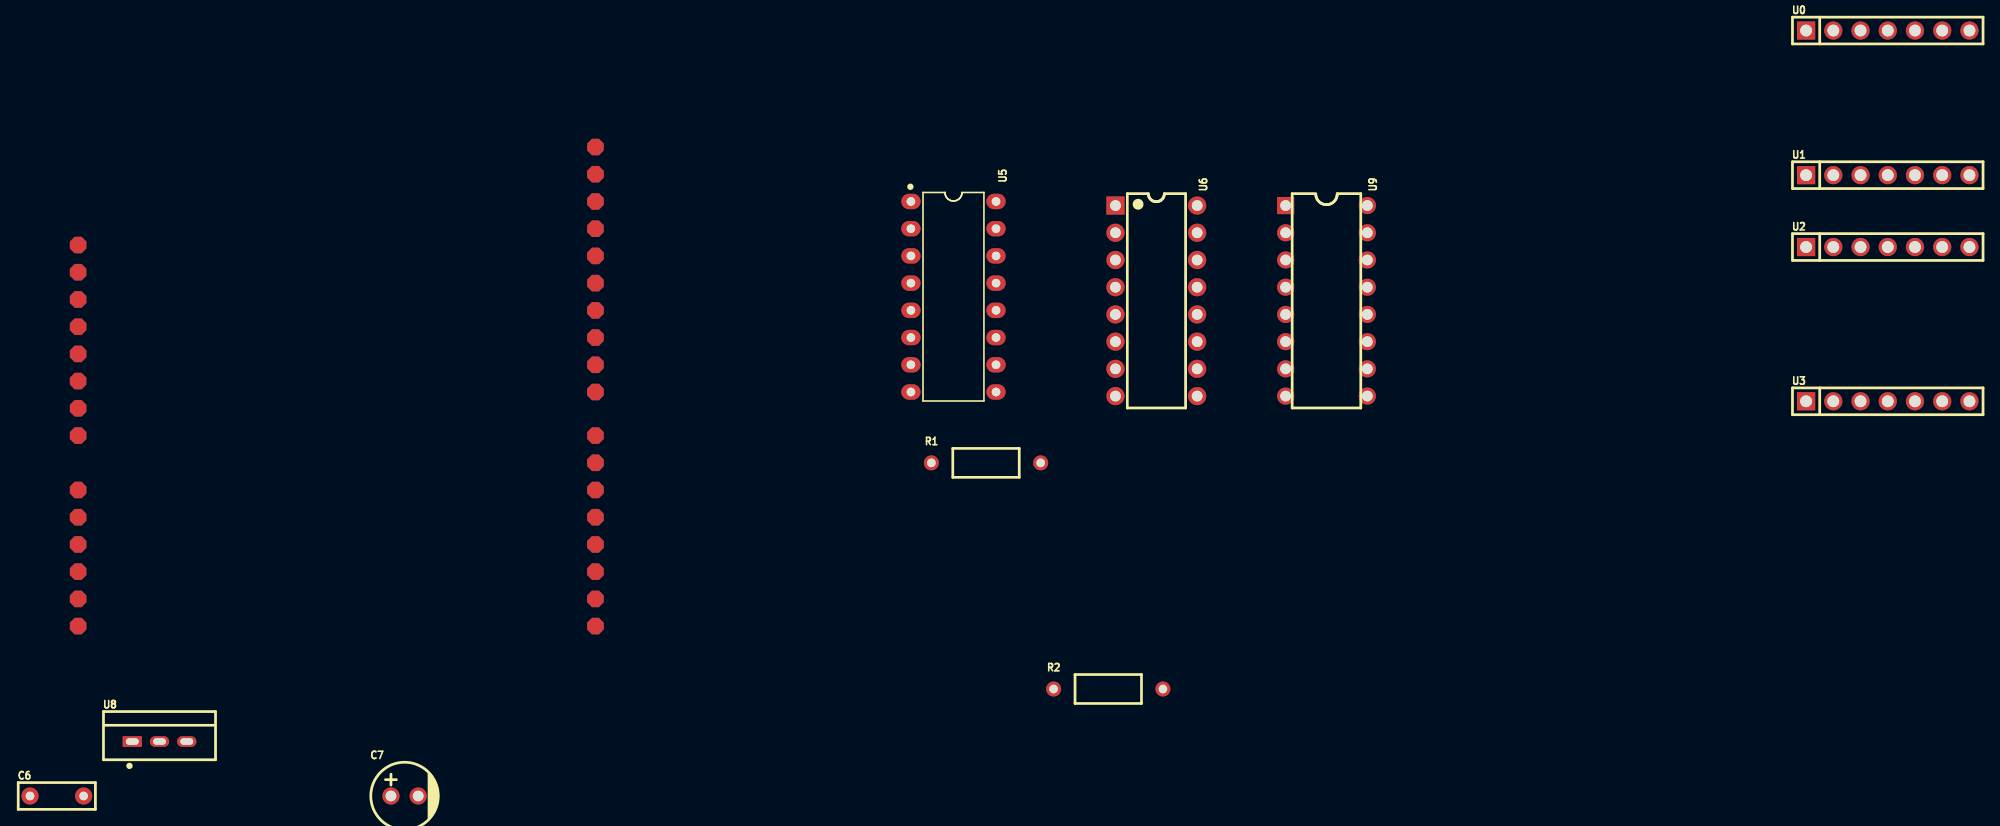
[diagram p4: board, top side]
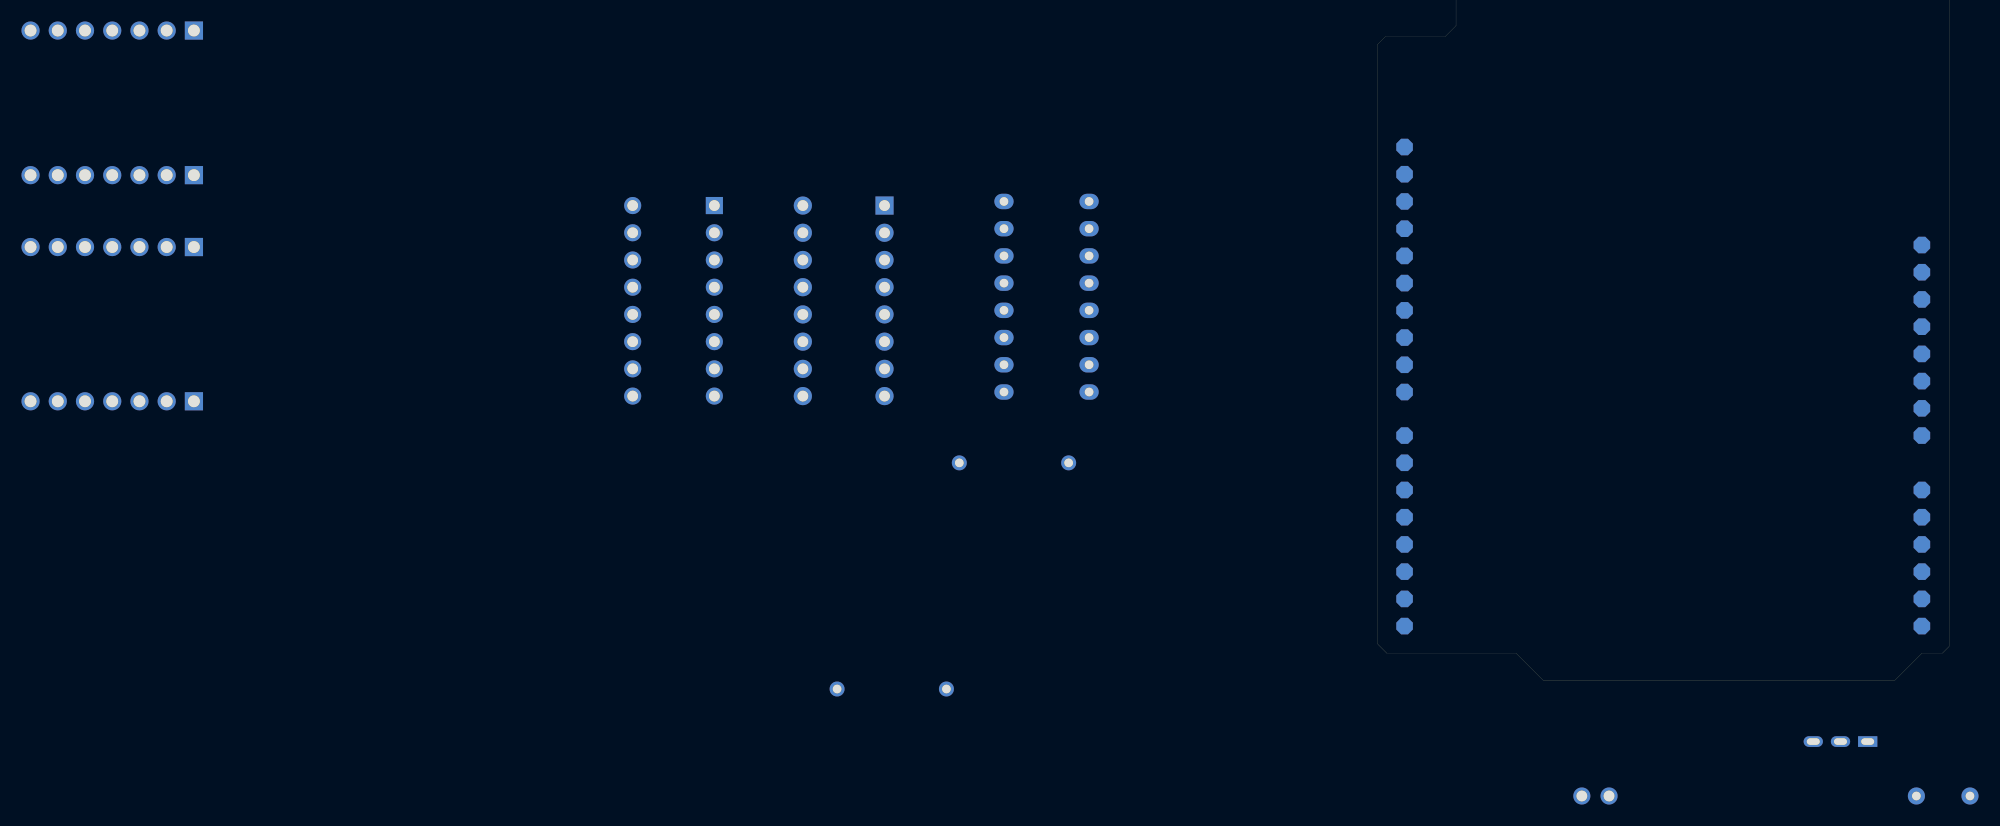
[diagram p5: board, bottom side, seen from below]

No outline. copper layers: Top Layer, Bottom Layer. Coordinates in mm from the lowest, leftmost part position.
Stack: Top Layer 0.035mm / Dielectric1 1.51mm FR4 er 4.5 / Bottom Layer 0.035mm

## Design rules (mm)
template: JLCPCB Capability(Two Layers Board)
spacing copperThickness1oz (default): track to track 0.102, other pairs 0.152 to 0.3
spacing copperThickness2oz: track to track 0.203, other pairs 0.152 to 0.3
track width copperThickness1oz (default): min 0.127, default 0.254, max 2.54
track width copperThickness2oz: min 0.203, default 0.254, max 2.54
differential pair differentialPair (default): width min 0.127, default 0.254, max 2.54; gap min 0.152, default 0.152
via viaSize (default): diameter min 0.5, default 0.61, max 10; hole min 0.3, default 0.305, max 6.3

## Placement (name value [footprint] x y rotation side)
C6  100nF  [CAP-TH_L7.2-W2.5-P5.00-D0.5]  0.55 0 0 top
C7  2.2uF  [CAP-TH_BD6.3-P2.50-D1.0-FD]  32.99 0 0 top
R1  10kΩ  [RES-TH_BD2.7-L6.2-P10.20-D0.4]  87.24 31.09 0 top
R2  10kΩ  [RES-TH_BD2.7-L6.2-P10.20-D0.4]  98.64 9.98 0 top
U0  HB-PH3-25417PB2GOP  [HDR-TH_7P-P2.54-V-M]  171.36 71.43 0 top
U1  HB-PH3-25417PB2GOP  [HDR-TH_7P-P2.54-V-M]  171.36 57.94 0 top
U2  HB-PH3-25417PB2GOP  [HDR-TH_7P-P2.54-V-M]  171.36 51.23 0 top
U3  HB-PH3-25417PB2GOP  [HDR-TH_7P-P2.54-V-M]  171.36 36.83 0 top
U4  Arduino Uno  [ARDUINO-R3]  0 79.35 270 top
U5  CD74HC4050E  [PDIP-16_L19.3-W6.4-P2.54-LS7.94-BL]  84.2 46.59 270 top
U6  74HC138AD  [PDIP-16_L19.7-W6.6-P2.54-LS7.6-BL]  103.12 46.21 270 top
U8  LF33CV  [TO-220-3_L10.2-W4.5-P2.54-L]  10.13 5.08 0 top
U9  74HC595N  [DIP-16_L19.8-W6.5-P2.54-LS7.6-BL]  119 46.21 270 top

## Footprints (pads in the part's own frame, mm; a bottom-side part is the same pattern mirrored in y, then rotated)
ARDUINO-R3
  custom 1.549x1.549 hole 1: 3V(35.56,2.54) 5V(38.1,2.54) A0(50.8,2.54) A1(53.34,2.54) A2(55.88,2.54) A3(58.42,2.54) A4(60.96,2.54) A5(63.499,2.54) AREF(23.876,50.8) D0(63.499,50.8) D1(60.96,50.8) D2(58.42,50.8) D3(55.88,50.8) D4(53.34,50.8) D5(50.8,50.8) D6(48.26,50.8) D7(45.72,50.8) D8(41.656,50.8) D9(39.116,50.8) D10(36.576,50.8) D11(34.036,50.8) D12(31.496,50.8) D13(28.956,50.8) GND(26.416,50.8) GND1(43.18,2.54) GND2(40.64,2.54) IOREF(30.48,2.54) RESERVED(27.94,2.54) RESET(33.02,2.54) SCL(18.796,50.8) SDA(21.336,50.8) VIN(45.72,2.54)
CAP-TH_BD6.3-P2.50-D1.0-FD
  round 1.6 hole 1: 1(-1.27,0) 2(1.27,0)
CAP-TH_L7.2-W2.5-P5.00-D0.5
  round 1.6 hole 0.8: 1(-2.5,0) 2(2.5,0)
DIP-16_L19.8-W6.5-P2.54-LS7.6-BL
  rect 1.6x1.6 hole 1: 1(-8.89,-3.81)
  round 1.6 hole 1: 2(-6.35,-3.81) 3(-3.81,-3.81) 4(-1.27,-3.81) 5(1.27,-3.81) 6(3.81,-3.81) 7(6.35,-3.81) 8(8.89,-3.81) 9(8.89,3.81) 10(6.35,3.81) 11(3.81,3.81) 12(1.27,3.81) 13(-1.27,3.81) 14(-3.81,3.81) 15(-6.35,3.81) 16(-8.89,3.81)
HDR-TH_7P-P2.54-V-M
  rect 1.7x1.7 hole 1.1: 1(-7.62,0)
  round 1.7 hole 1.1: 2(-5.08,0) 3(-2.54,0) 4(0,0) 5(2.54,0) 6(5.08,0) 7(7.62,0)
PDIP-16_L19.3-W6.4-P2.54-LS7.94-BL
  oval 1.44x1.8 hole 0.8: 1(-8.89,-3.97) 2(-6.35,-3.97) 3(-3.81,-3.97) 4(-1.27,-3.97) 5(1.27,-3.97) 6(3.81,-3.97) 7(6.35,-3.97) 8(8.89,-3.97) 9(8.89,3.97) 10(6.35,3.97) 11(3.81,3.97) 12(1.27,3.97) 13(-1.27,3.97) 14(-3.81,3.97) 15(-6.35,3.97) 16(-8.89,3.97)
PDIP-16_L19.7-W6.6-P2.54-LS7.6-BL
  rect 1.7x1.7 hole 1: 1(-8.89,-3.81)
  round 1.7 hole 1: 2(-6.35,-3.81) 3(-3.81,-3.81) 4(-1.27,-3.81) 5(1.27,-3.81) 6(3.81,-3.81) 7(6.35,-3.81) 8(8.89,-3.81) 9(8.89,3.81) 10(6.35,3.81) 11(3.81,3.81) 12(1.27,3.81) 13(-1.27,3.81) 14(-3.81,3.81) 15(-6.35,3.81) 16(-8.89,3.81)
RES-TH_BD2.7-L6.2-P10.20-D0.4
  round 1.4 hole 0.8: 1(-5.1,0) 2(5.1,0)
TO-220-3_L10.2-W4.5-P2.54-L
  rect 1.8x1 hole 1.2x0.6: 1(-2.54,0)
  oval 1.8x1 hole 1.2x0.6: 2(0,0) 3(2.54,0)

## Nets
As in the schematic, except:
A5: U4.D8 U5.9
RST0: U9.15
SER: U4.D5 U9.14

Pads without a net: U4 3V A0 A1 A2 A3 A4 A5 AREF D0 D1 D2 D3 D4 GND GND1 IOREF RESERVED RESET SCL SDA VIN; U5 13 16; U6 7 9 10 11; U9 4 5 6 7 9

# Board PCB1_1
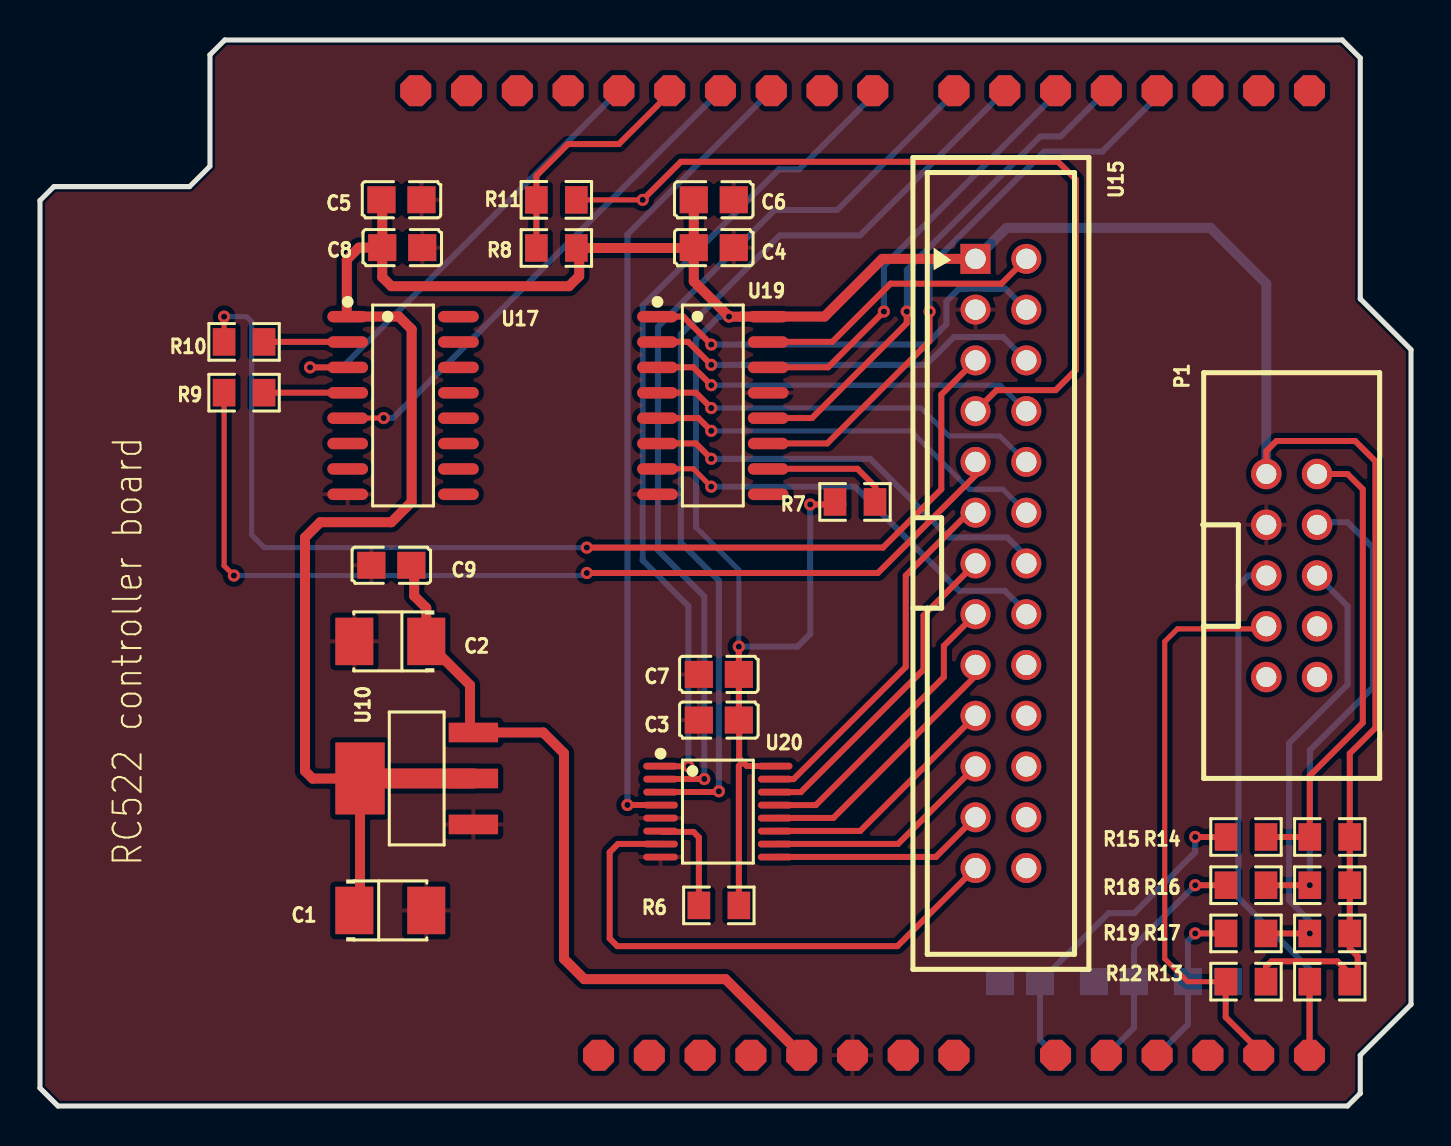
[diagram p6: board, top side]
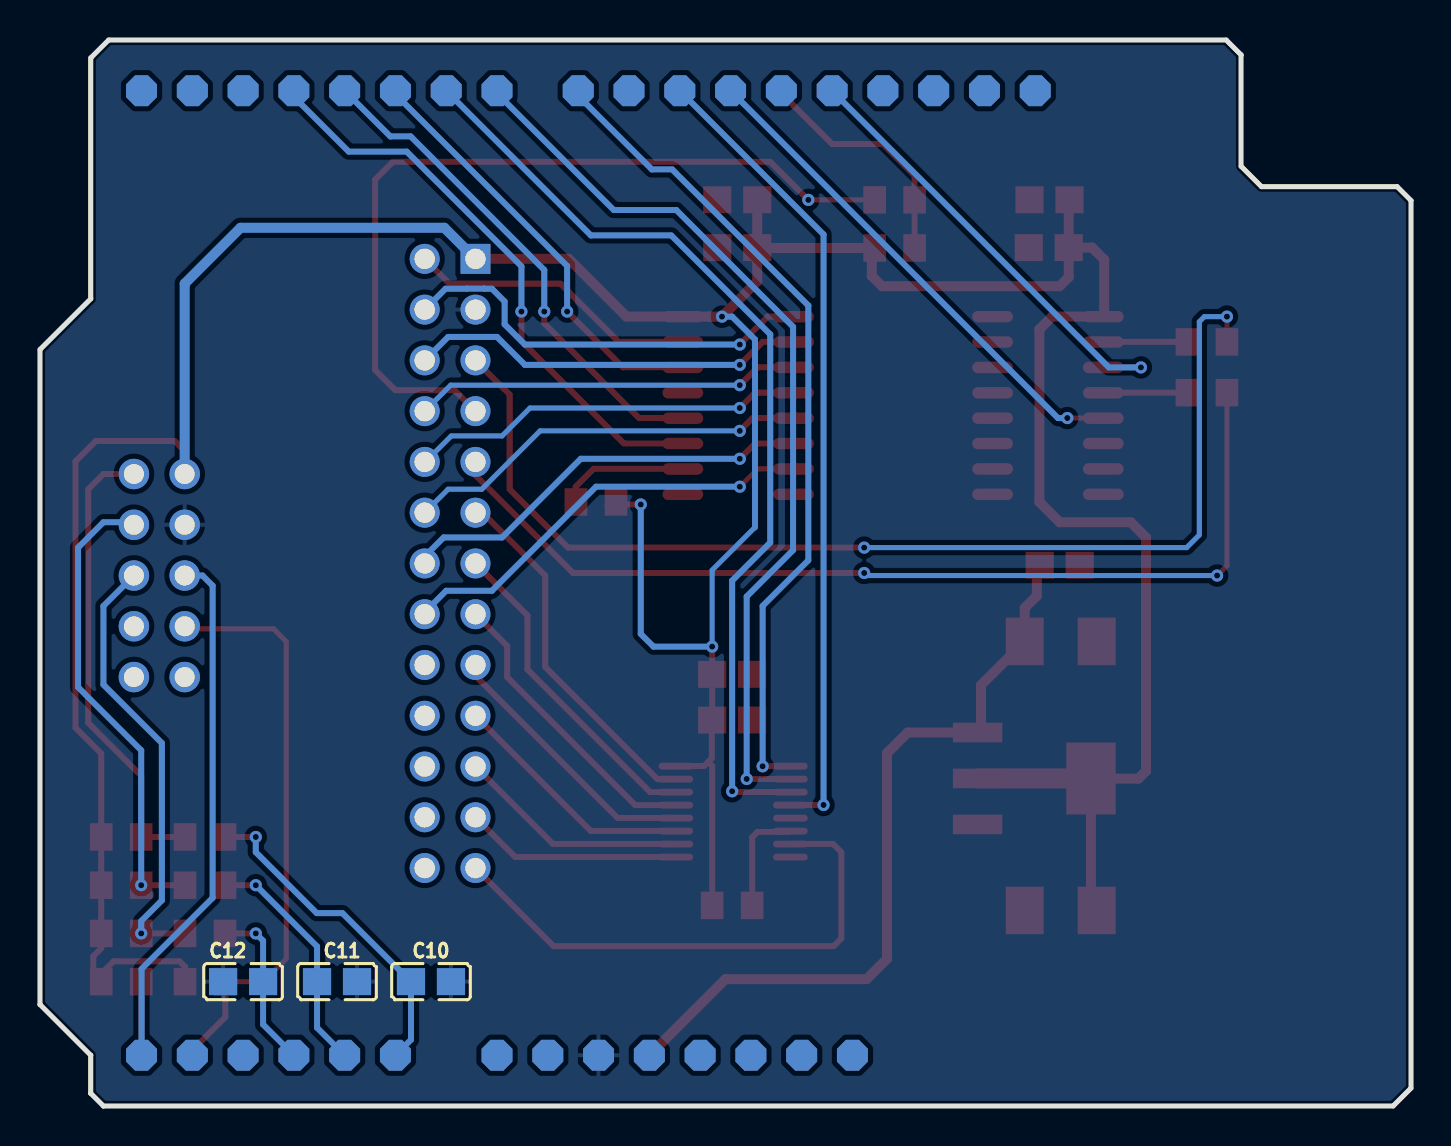
[diagram p7: board, bottom side, seen from below]

Outline 68.58 x 53.34 mm; copper layers: Top Layer, Bottom Layer. Coordinates in mm from the lower left corner of the outline.
Outline path: 0,45.31 0.69,46 7.48,46 8.5,47.02 8.5,52.59 9.25,53.34 65.14,53.34 66.04,52.44 66.04,40.39 68.58,37.85 68.58,5.08 66.04,2.54 66.04,0.64 65.41,0 0.9,0 0,0.9 0,45.31
Stack: Top Layer 0.035mm / Dielectric1 1.51mm FR4 er 4.5 / Bottom Layer 0.035mm

## Design rules (mm)
template: JLCPCB Capability(Two Layers Board)
spacing copperThickness1oz (default): track to track 0.102, other pairs 0.152 to 0.3
spacing copperThickness2oz: track to track 0.203, other pairs 0.152 to 0.3
track width copperThickness1oz (default): min 0.127, default 0.254, max 2.54
track width copperThickness2oz: min 0.203, default 0.254, max 2.54
differential pair differentialPair (default): width min 0.127, default 0.254, max 2.54; gap min 0.152, default 0.152
via viaSize (default): diameter min 0.5, default 0.61, max 10; hole min 0.3, default 0.305, max 6.3

## Placement (name value [footprint] x y rotation side)
C1  10uF  [CAP-SMD_L3.5-W2.8-FD]  17.52 9.79 0 top
C2  10uF  [CAP-SMD_L3.5-W2.8-FD]  17.52 23.25 180 top
C3  100nF  [C0805]  33.96 19.31 0 top
C4  100nF  [C0805]  33.7 42.95 180 top
C5  100nF  [C0805]  18.08 45.35 0 top
C6  1uF  [C0805]  33.7 45.35 180 top
C7  1uF  [C0805]  33.96 21.6 0 top
C8  1uF  [C0805]  18.12 42.95 0 top
C9  100nF  [C0805]  17.57 27.06 180 top
C10  100nF  [C0805]  49.02 6.22 180 bottom
C11  100nF  [C0805]  53.72 6.22 180 bottom
C12  100nF  [C0805]  58.42 6.22 0 bottom
P1  2.54-2*5P简牛  [IDC-TH_10P-P2.54_C5665]  62.61 26.54 270 top
R6  10kΩ  [R0805]  33.96 10.04 0 top
R7  10kΩ  [R0805]  40.77 30.23 0 top
R8  10kΩ  [R0805]  25.83 42.93 0 top
R9  33Ω  [R0805]  10.21 35.69 0 top
R10  33Ω  [R0805]  10.21 38.23 0 top
R11  10kΩ  [R0805]  25.83 45.34 0 top
R12  4k7Ω  [R0805]  60.33 6.22 180 top
R13  4k7Ω  [R0805]  64.52 6.22 180 top
R14  10kΩ  [R0805]  64.52 13.46 180 top
R15  1kΩ  [R0805]  60.33 13.46 180 top
R16  10kΩ  [R0805]  64.52 11.05 180 top
R17  10kΩ  [R0805]  64.52 8.64 180 top
R18  1kΩ  [R0805]  60.33 11.05 180 top
R19  1kΩ  [R0805]  60.33 8.64 180 top
U4  Arduino Uno  [ARDUINO-R3]  0 0 0 top
U10  LM1117MP-3.3  [SOT-223-4_L6.5-W3.5-P2.30-LS7.0-BR]  18.84 16.39 0 top
U15  ZX-IDC2.54-2-13PZZ  [IDC-TH_26P-P2.54_ZX-IDC2.54-2-13PZZ]  48.07 27.15 270 top
U17  CD74HC4050NSR  [SO-16_L9.9-W3.9-P1.27-LS6.0-BL]  18.16 35.05 270 top
U19  74HC595D,112  [SO-16_L9.9-W3.9-P1.27-LS6.0-BL]  33.66 35.05 270 top
U20  SN74LVC138APWR  [TSSOP-16_L5.0-W4.4-P0.65-LS6.4-BL]  33.91 14.73 270 top

## Footprints (pads in the part's own frame, mm; a bottom-side part is the same pattern mirrored in y, then rotated)
ARDUINO-R3
  custom 1.549x1.549 hole 1: 3V(35.56,2.54) 5V(38.1,2.54) A0(50.8,2.54) A1(53.34,2.54) A2(55.88,2.54) A3(58.42,2.54) A4(60.96,2.54) A5(63.499,2.54) AREF(23.876,50.8) D0(63.499,50.8) D1(60.96,50.8) D2(58.42,50.8) D3(55.88,50.8) D4(53.34,50.8) D5(50.8,50.8) D6(48.26,50.8) D7(45.72,50.8) D8(41.656,50.8) D9(39.116,50.8) D10(36.576,50.8) D11(34.036,50.8) D12(31.496,50.8) D13(28.956,50.8) GND(26.416,50.8) GND1(43.18,2.54) GND2(40.64,2.54) IOREF(30.48,2.54) RESERVED(27.94,2.54) RESET(33.02,2.54) SCL(18.796,50.8) SDA(21.336,50.8) VIN(45.72,2.54)
C0805
  rect 1.41x1.35 smd: 1(-1,0) 2(1,0)
CAP-SMD_L3.5-W2.8-FD
  rect 1.9x2.376 smd: 1(-1.798,0) 2(1.798,0)
IDC-TH_10P-P2.54_C5665
  round 1.524 hole 1: 1(-5.08,-1.27) 2(-5.08,1.27) 3(-2.54,-1.27) 4(-2.54,1.27) 5(0,-1.27) 6(0,1.27) 7(2.54,-1.27) 8(2.54,1.27) 9(5.08,-1.27) 10(5.08,1.27)
IDC-TH_26P-P2.54_ZX-IDC2.54-2-13PZZ
  rect 1.5x1.5 hole 1.02: 1(-15.24,-1.27)
  round 1.5 hole 1.02: 2(-15.24,1.27) 3(-12.7,-1.27) 4(-12.7,1.27) 5(-10.16,-1.27) 6(-10.16,1.27) 7(-7.62,-1.27) 8(-7.62,1.27) 9(-5.08,-1.27) 10(-5.08,1.27) 11(-2.54,-1.27) 12(-2.54,1.27) 13(0,-1.27) 14(0,1.27) 15(2.54,-1.27) 16(2.54,1.27) 17(5.08,-1.27) 18(5.08,1.27) 19(7.62,-1.27) 20(7.62,1.27) 21(10.16,-1.27) 22(10.16,1.27) 23(12.7,-1.27) 24(12.7,1.27) 25(15.24,-1.27) 26(15.24,1.27)
R0805
  rect 1.133x1.377 smd: 1(-1,0) 2(1,0)
SO-16_L9.9-W3.9-P1.27-LS6.0-BL
  oval 0.574x2.038 smd: 1(-4.445,-2.769) 2(-3.175,-2.769) 3(-1.905,-2.769) 4(-0.635,-2.769) 5(0.635,-2.769) 6(1.905,-2.769) 7(3.175,-2.769) 8(4.445,-2.769) 9(4.445,2.769) 10(3.175,2.769) 11(1.905,2.769) 12(0.635,2.769) 13(-0.635,2.769) 14(-1.905,2.769) 15(-3.175,2.769) 16(-4.445,2.769)
SOT-223-4_L6.5-W3.5-P2.30-LS7.0-BR
  rect 2.47x0.98 smd: 1(2.835,-2.3) 2(2.835,0) 3(2.835,2.3)
  rect 2.47x3.6 smd: 4(-2.835,0)
TSSOP-16_L5.0-W4.4-P0.65-LS6.4-BL
  oval 0.343x1.732 smd: 1(-2.275,-2.866) 2(-1.625,-2.866) 3(-0.975,-2.866) 4(-0.325,-2.866) 5(0.325,-2.866) 6(0.975,-2.866) 7(1.625,-2.866) 8(2.275,-2.866) 9(2.275,2.866) 10(1.625,2.866) 11(0.975,2.866) 12(0.325,2.866) 13(-0.325,2.866) 14(-0.975,2.866) 15(-1.625,2.866) 16(-2.275,2.866)

## Nets
As in the schematic.

Pads without a net: P1 8 9 10; U4 3V A3 AREF D0 D1 D2 D9 GND GND1 IOREF RESERVED RESET SCL SDA VIN; U15 18 20 22 24 26; U17 6 7 9 10 11 12 13 14 15 16; U19 9

## Via types
v1: diameter 0.61, hole 0.305, Top Layer to Bottom Layer, 29 vias

## Routing (per net, layer and track width the routed paths; a pad name or vN(x,y) marks a point on that pad's centre or on a via; arc(x,y) is an arc through that point)
3V3: length 202.6
  Top Layer w0.3: 35.15,17.22 35.36,17.01 36.82,17.01 ; 35.15,17.22 34.96,17.02 R6.2 ; 35.15,17.22 34.97,17.4 34.97,19.29 C3.2 C7.2 v1(34.96,22.99) ; R12.1 61.33,6.97 61.59,7.24 64.9,7.24 65.52,6.62 R13.1 65.91,6.62 65.91,7.49 65.52,7.89 R17.1 R16.1 R14.1 65.52,17.64 66.8,18.92 66.8,32.26 65.79,33.27 61.85,33.27 61.34,32.77 P1.1 ; v1(38.53,30.1) 40.2,30.1
  Top Layer w0.5: U15.1 42.13,42.39 39.25,39.5 35.11,39.5 35.1,39.5 v1(34.47,39.5) 32.7,41.26 C4.2 ; C8.1 17.12,45.31 C5.1 ; C8.1 15.95,42.95 15.35,42.35 15.35,39.5 17.95,39.5 18.59,38.86 18.59,30.23 17.57,29.21 14.02,29.21 13.26,28.45 13.26,16.76 13.64,16.38 16,16.38 U10.4 16.01,10.07 C1.1 ; C8.1 17.12,41.47 17.57,41.02 26.46,41.02 26.97,41.53 26.97,42.79 R8.2 32.69,42.93 C4.2 ; C4.2 C6.2
  Top Layer w1: U10.4 U10.2
  Bottom Layer w0.254: v1(34.96,22.99) 34.96,26.81 32.81,28.96
  Bottom Layer w0.3: 32.81,28.96 32.81,38.35 33.96,39.5 v1(34.47,39.5) ; v1(34.96,22.99) 37.89,22.99 38.53,23.62 v1(38.53,30.1)
  Bottom Layer w0.5: P1.1 61.34,41.15 58.55,43.94 48.35,43.94 U15.1
5V: length 38.8
  Top Layer w0.5: U4.5V 34.29,6.35 27.23,6.35 26.21,7.37 26.21,17.65 25.17,18.69 U10.3 21.51,18.86 21.51,21.06 C2.1 19.32,24.92 18.72,25.53 18.72,26.91 C9.1
A: length 41.5
  Top Layer w0.3: 31.09,17.01 31.11,17 v1(32.43,17)
  Bottom Layer w0.3: v1(32.43,17) 32.43,25.02 30.15,27.3 30.15,40.05 36.96,46.86 37.97,46.86 41.66,50.55 U4.D8
B: length 45.5
  Top Layer w0.3: 31.09,16.36 v1(33.23,16.36)
  Bottom Layer w0.3: U4.D7 45.72,50.67 39.88,44.83 36.75,44.83 30.91,38.99 30.91,27.81 33.23,25.49 v1(33.23,16.36)
BUTTON1: length 16.8
  Top Layer w0.3: R15.2 v1(57.78,13.46)
  Bottom Layer w0.3: v1(57.78,13.46) 57.78,12.7 54.74,9.65 53.45,9.65 C10.1 50.02,3.32 U4.A0
BUTTON2: length 11.9
  Top Layer w0.3: R18.2 v1(57.78,11.05)
  Bottom Layer w0.3: U4.A1 54.72,3.92 C11.1 54.72,7.98 v1(57.78,11.05)
BUTTON3: length 8.4
  Top Layer w0.3: R19.2 v1(57.78,8.64)
  Bottom Layer w0.3: U4.A2 57.42,4.08 C12.1 57.42,8.27 v1(57.78,8.64)
C: length 47.8
  Top Layer w0.3: v1(33.96,15.75) 33.92,15.71 31.09,15.71
  Bottom Layer w0.3: U4.D6 41.02,43.56 37,43.56 32.05,38.61 32.05,28.19 33.96,26.29 v1(33.96,15.75)
CLK: length 29.1
  Top Layer w0.3: 36.47,33.15 39.38,33.15 44.5,38.27 v1(44.5,39.75)
  Bottom Layer w0.3: v1(44.5,39.75) 44.5,42.02 50.23,47.75 53.13,47.75 55.88,50.5 U4.D3
CS: length 40.4
  Top Layer w0.3: 31.09,15.06 v1(29.38,15.06)
  Bottom Layer w0.3: U4.D10 29.38,43.61 v1(29.38,15.06)
LATCH: length 25.2
  Top Layer w0.3: 36.47,34.42 38.61,34.42 43.36,39.16 v1(43.36,39.75)
  Bottom Layer w0.3: v1(43.36,39.75) 43.36,41.83 50.04,48.51 51.05,48.51 U4.D4
MISO: length 41.5
  Top Layer w0.254: R11.2 v1(30.15,45.34)
  Top Layer w0.3: v1(30.15,45.34) 32.05,47.24 50.93,47.24 51.82,46.35 51.82,36.83 50.81,35.82 47.85,35.82 U15.7
MOSI: length 49.2
  Top Layer w0.254: R9.1 9.21,27.03 v1(9.7,26.54)
  Top Layer w0.3: U15.9 46.8,31.56 41.91,26.67 v1(27.35,26.67)
  Bottom Layer w0.254: v1(27.35,26.67) 27.23,26.54 v1(9.7,26.54)
MOSI_5: length 25.5
  Top Layer w0.254: 15.35,34.42 v1(17.19,34.42)
  Bottom Layer w0.3: v1(17.19,34.42) 17.66,34.42 U4.D11
NSS0: length 18.2
  Top Layer w0.3: U15.11 46.45,29.69 43.31,26.54 43.31,21.97 37.69,16.36 U20.15
NSS1: length 16.3
  Top Layer w0.3: U20.14 38.06,15.71 44.2,21.84 44.2,24.55 U15.13
NSS2: length 14.9
  Top Layer w0.3: U20.13 38.81,15.06 45.21,21.46 45.21,23.02 U15.15
NSS3: length 13.5
  Top Layer w0.3: 36.82,14.41 39.69,14.41 46.8,21.52 U15.17
NSS4: length 12.4
  Top Layer w0.3: 36.82,13.76 41.03,13.76 U15.19
NSS5: length 11.6
  Top Layer w0.3: U15.21 42.92,13.11 36.82,13.11
NSS6: length 10.8
  Top Layer w0.3: 36.82,12.46 44.81,12.46 U15.23
NSS7: length 27.2
  Top Layer w0.3: 31.09,13.11 28.91,13.11 28.5,12.7 28.5,8.38 28.88,8 42.89,8 U15.25
RST0: length 14.6
  Top Layer w0.3: U15.2 48.1,41.15 42.55,41.15 39.63,38.23 36.47,38.23
RST1: length 21.2
  Top Layer w0.3: 30.93,39.5 32.17,39.5 v1(33.58,38.1)
  Bottom Layer w0.3: v1(33.58,38.1) 44.32,38.1 45.34,39.12 45.34,40.26 45.97,40.89 46.35,40.89 46.36,40.9 47.23,40.9 47.24,40.89 48.29,40.89 U15.4
RST2: length 19.9
  Top Layer w0.3: 30.93,38.23 32.43,38.23 v1(33.58,37.08)
  Bottom Layer w0.3: U15.6 48.16,38.48 45.72,38.48 44.32,37.08 v1(33.58,37.08)
RST3: length 19.3
  Top Layer w0.3: 30.93,36.96 32.68,36.96 v1(33.58,36.07)
  Bottom Layer w0.254: v1(33.58,36.07) 48.04,36.07 U15.8
RST4: length 19.8
  Top Layer w0.3: v1(33.58,34.92) 32.81,35.69 30.93,35.69
  Bottom Layer w0.254: v1(33.58,34.92) 44.07,34.92 45.47,33.53 48.01,33.53 49.31,32.23 U15.10
RST5: length 20.4
  Top Layer w0.3: 30.93,34.42 32.93,34.42 v1(33.58,33.78)
  Bottom Layer w0.254: v1(33.58,33.78) 43.56,33.78 46.48,30.86 48.16,30.86 U15.12
RST6: length 21.1
  Top Layer w0.3: v1(33.58,32.38) 32.81,33.15 30.93,33.15
  Bottom Layer w0.3: U15.14 49.34,27.5 48.39,28.45 45.47,28.45 41.53,32.38 v1(33.58,32.38)
RST7: length 21.5
  Top Layer w0.254: v1(33.58,30.99) 32.68,31.88 30.93,31.88
  Bottom Layer w0.3: U15.16 49.34,24.7 48.26,25.78 45.97,25.78 40.77,30.99 v1(33.58,30.99)
SCK: length 56.5
  Top Layer w0.254: R10.1 v1(9.21,39.5)
  Top Layer w0.3: U15.5 45.09,35.6 45.09,30.86 42.16,27.94 v1(27.35,27.94)
  Bottom Layer w0.254: v1(27.35,27.94) 11.22,27.94 10.59,28.57 10.59,39.24 10.34,39.5 v1(9.21,39.5)
SCK_5: length 23
  Top Layer w0.3: 15.35,36.96 15.34,36.96 v1(13.51,36.96)
  Bottom Layer w0.3: U4.D13 15.11,36.96 v1(13.51,36.96)
SCL: length 30.3
  Top Layer w0.3: U4.A5 63.5,6.21 R13.2
  Bottom Layer w0.3: U4.A5 63.5,6.86 59.94,10.41 59.94,26.03 60.45,26.54 P1.5
SDA: length 29.2
  Top Layer w0.254: P1.7 61.21,23.88 56.9,23.88 56.26,23.24 56.26,7.37 57.4,6.22 R12.2
  Top Layer w0.3: U4.A4 60.96,2.79 59.31,4.44 59.31,6.21 R12.2
SERIAL_DATA: length 21.5
  Top Layer w0.3: 36.47,36.96 39.42,36.96 v1(42.21,39.75)
  Bottom Layer w0.3: U4.D5 50.8,50.62 42.21,42.04 v1(42.21,39.75)
$1N4612: length 5.4
  Top Layer w0.3: R6.1 32.96,13.45 32.69,13.72 31.14,13.72 31.09,13.76
$1N11217: length 4.1
  Top Layer w0.3: R9.2 15.35,35.69
$1N11260: length 4.1
  Top Layer w0.3: R10.2 15.35,38.23
$1N11303: length 12.1
  Top Layer w0.3: R8.1 R11.1 24.83,46.55 26.42,48.13 28.96,48.13 31.5,50.67 U4.D12
$1N11361: length 6.4
  Top Layer w0.3: 41.78,30.23 41.78,30.99 40.89,31.88 36.47,31.88
$1N13694: length 23.3
  Top Layer w0.3: P1.2 65.41,31.62 66.17,30.86 66.17,19.18 63.52,16.53 R14.2 R15.1
$1N13954: length 23.8
  Top Layer w0.3: R18.1 v1(63.52,11.05)
  Bottom Layer w0.3: P1.4 64.01,29.21 65.41,29.21 66.68,27.94 66.68,20.95 63.52,17.8 v1(63.52,11.05)
$1N14026: length 22.4
  Top Layer w0.3: R19.1 v1(63.52,8.64)
  Bottom Layer w0.3: P1.6 65.41,25.02 65.41,21.08 62.48,18.16 62.48,10.29 63.52,9.25 v1(63.52,8.64)

## Copper pours and planes (outline as drawn; the poured copper is in the pictures)
GND on Top Layer: -4.95,56.01 71.5,56.01 71.5,-2.29 -4.95,-2.29
GND on Bottom Layer: -4.95,55.63 74.04,55.63 74.04,-5.46 -4.95,-5.46

## Text on the board
Top Silkscreen Layer: RC522 controller board
